# EAGLE design Ddraig (EAGLE 9.5.1)

## Sheet 1 of 8: Main
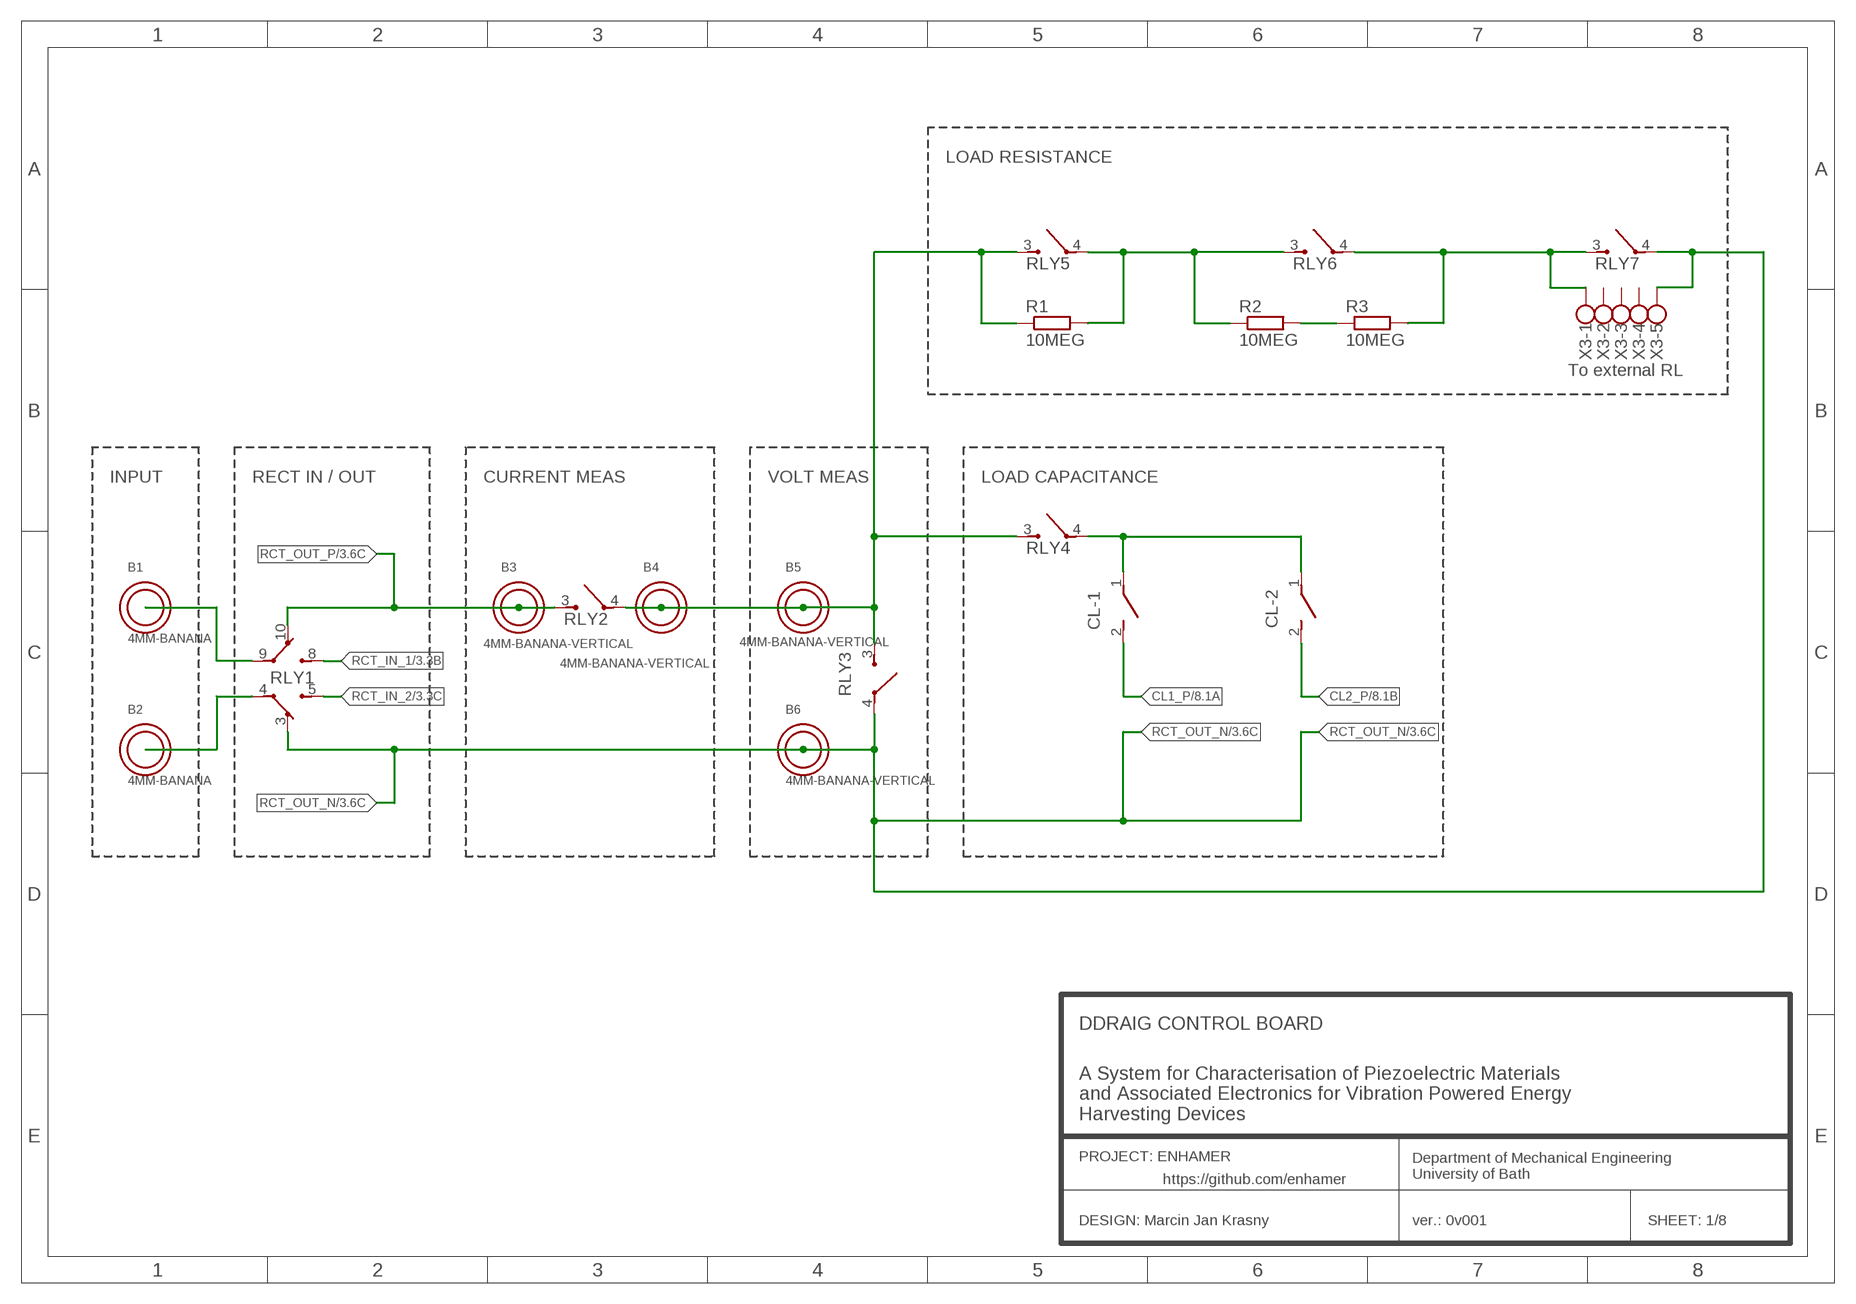
[diagram p0: schematic, sheet 1]

### Parts
B1  4MM-BANANA  4MM-BANANA-VERTICAL  [4MM-BANANA-VERTICAL]
B2  4MM-BANANA  4MM-BANANA-VERTICAL  [4MM-BANANA-VERTICAL]
B3  4MM-BANANA-VERTICAL  [4MM-BANANA-VERTICAL]
B4  4MM-BANANA-VERTICAL  [4MM-BANANA-VERTICAL]
B5  4MM-BANANA-VERTICAL  [4MM-BANANA-VERTICAL]
B6  4MM-BANANA-VERTICAL  [4MM-BANANA-VERTICAL]
CL-1  DIP_SWITCH_01  [DIP_SWITCH_01]
CL-2  DIP_SWITCH_01  [DIP_SWITCH_01]
R1  10MEG  R-EU_R2010  [R2010]
R2  10MEG  R-EU_R2010  [R2010]
R3  10MEG  R-EU_R2010  [R2010]
RLY1  AXICOM-V23079-D  [AXICOM-V23079-SMT_MONO]
RLY2  OMRON-G5CA-1A-E  [G5CA_MJK]
RLY3  OMRON-G5CA-1A-E  [G5CA_MJK]
RLY4  OMRON-G5CA-1A-E  [G5CA_MJK]
RLY5  OMRON-G5CA-1A-E  [G5CA_MJK]
RLY6  OMRON-G5CA-1A-E  [G5CA_MJK]
RLY7  OMRON-G5CA-1A-E  [G5CA_MJK]
X3  5PIN_CONN_RAST3.5MM  [5PIN_CONN_RAST3.5MM]

### Nets
CL1_P: CL-1.2 ; also sheet 8
CL2_P: CL-2.2 ; also sheet 8
N$1: B1.1 RLY1.9
N$2: B2.1 RLY1.4
N$4: B4.1 B5.1 R1.1 RLY2.4 RLY3.3 RLY4.3 RLY5.3
N$6: R3.2 RLY6.4 RLY7.3 X3.1
N$8: CL-1.1 CL-2.1 RLY4.4
N$10: R1.2 R2.1 RLY5.4 RLY6.3
N$11: R2.2 R3.1
RCT_IN_1: RLY1.8 ; also sheet 3
RCT_IN_2: RLY1.5 ; also sheet 3
RCT_OUT_N: B6.1 RLY1.3 RLY3.4 RLY7.4 X3.5 ; also sheet 3,8
RCT_OUT_P: B3.1 RLY1.10 RLY2.3 ; also sheet 3
Unconnected: X3.2 X3.3 X3.4

### Notes on the sheet
- LOAD RESISTANCE
- To external RL
- INPUT | RECT IN / OUT | CURRENT MEAS | VOLT MEAS | LOAD CAPACITANCE
- DDRAIG CONTROL BOARD
- A System for Characterisation of Piezoelectric Materials 
  and Associated Electronics for Vibration Powered Energy 
  Harvesting Devices
- PROJECT: ENHAMER
- Department of Mechanical Engineering
  University of Bath
- https://github.com/enhamer
- DESIGN: Marcin Jan Krasny | ver.: 0v001 | SHEET: 1/8

## Sheet 2 of 8: Power Supply
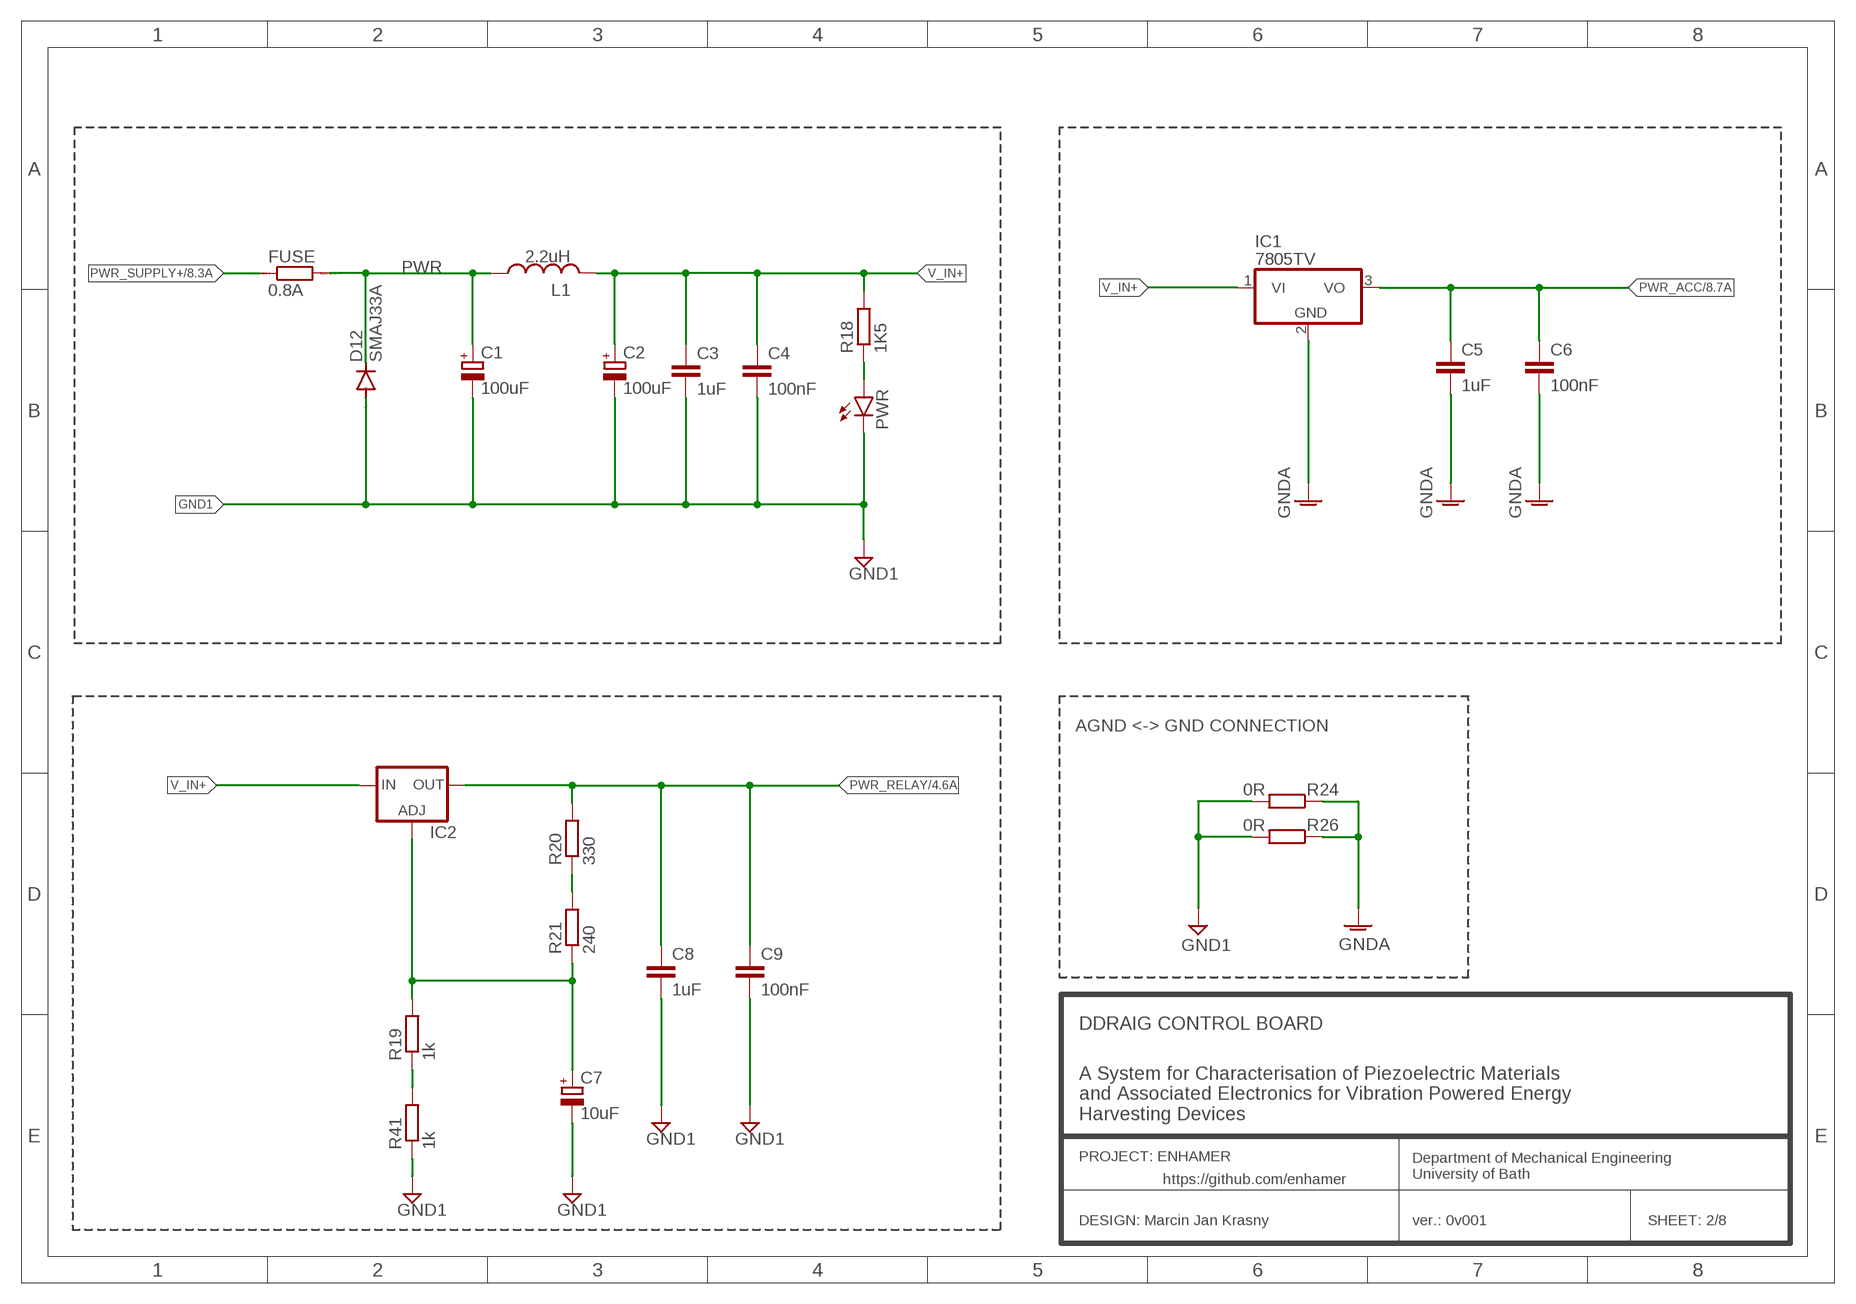
[diagram p1: schematic, sheet 2]

### Parts
C1  100uF  C_POL  [PANASONIC-CAPAE660X800N]
C2  100uF  C_POL  [PANASONIC-CAPAE660X800N]
C3  1uF  C-EUC0805  [C0805]
C4  100nF  C-EUC0805  [C0805]
C5  1uF  C-EUC0805  [C0805]
C6  100nF  C-EUC0805  [C0805]
C7  10uF  C_POL  [PANASONIC-CAPAE660X800N]
C8  1uF  C-EUC0805  [C0805]
C9  100nF  C-EUC0805  [C0805]
D12  SMAJ33A  DIODE-DO-214AC  [DO-214AC]
FUSE  0.8A  R1206  [1206]
IC1  7805TV  [TO220V]
IC2  LM317TS  [317TS]
L1  2.2uH  L0805_[2016_METRIC]  [0805]
PWR  LEDSMT1206  [1206]
R18  1K5  R-EU_R0805  [R0805]
R19  1k  R-EU_R0805  [R0805]
R20  330  R-EU_R0805  [R0805]
R21  240  R-EU_R0805  [R0805]
R24  0R  R-EU_R0805  [R0805]
R26  0R  R-EU_R0805  [R0805]
R41  1k  R-EU_R0805  [R0805]

### Nets
GND1: C1.2(-) C2.2(-) C3.2 C4.2 C7.2(-) C8.2 C9.2 D12.A PWR.C R24.2 R26.2 R41.1 ; also sheet 4,5,6,7,8
GNDA: C5.2 C6.2 IC1.2(GND) R24.1 R26.1 ; also sheet 8
N$41: PWR.A R18.1
N$42: C7.1(+) IC2.1(ADJ) R19.2 R21.1
N$43: R20.1 R21.2
N$57: R19.1 R41.2
PWR: C1.1(+) D12.C FUSE.2 L1.1
PWR_ACC: C5.1 C6.1 IC1.3(VO) ; also sheet 8
PWR_RELAY: C8.1 C9.1 IC2.2(OUT) R20.2 ; also sheet 4,5
PWR_SUPPLY+: FUSE.1 ; also sheet 8
V_IN+: C2.1(+) C3.1 C4.1 IC1.1(VI) IC2.3(IN) L1.2 R18.2

### Notes on the sheet
- Choke Input pi-Filter
- Fc     =    1 / (2pi x SQRT(L x C) [Hz]
  https://www.eeeguide.com/low-pass-filter/
- Reverse voltage protection
- V_in 8-15V
- AGND <-> GND CONNECTION
- Vout= 1.25 x (1+([R41+R19]/[R21+R20]))
- Vout = 5.28 V
- DDRAIG CONTROL BOARD
- A System for Characterisation of Piezoelectric Materials 
  and Associated Electronics for Vibration Powered Energy 
  Harvesting Devices
- PROJECT: ENHAMER
- Department of Mechanical Engineering
  University of Bath
- https://github.com/enhamer
- DESIGN: Marcin Jan Krasny | ver.: 0v001 | SHEET: 2/8

## Sheet 3 of 8: Rectifier
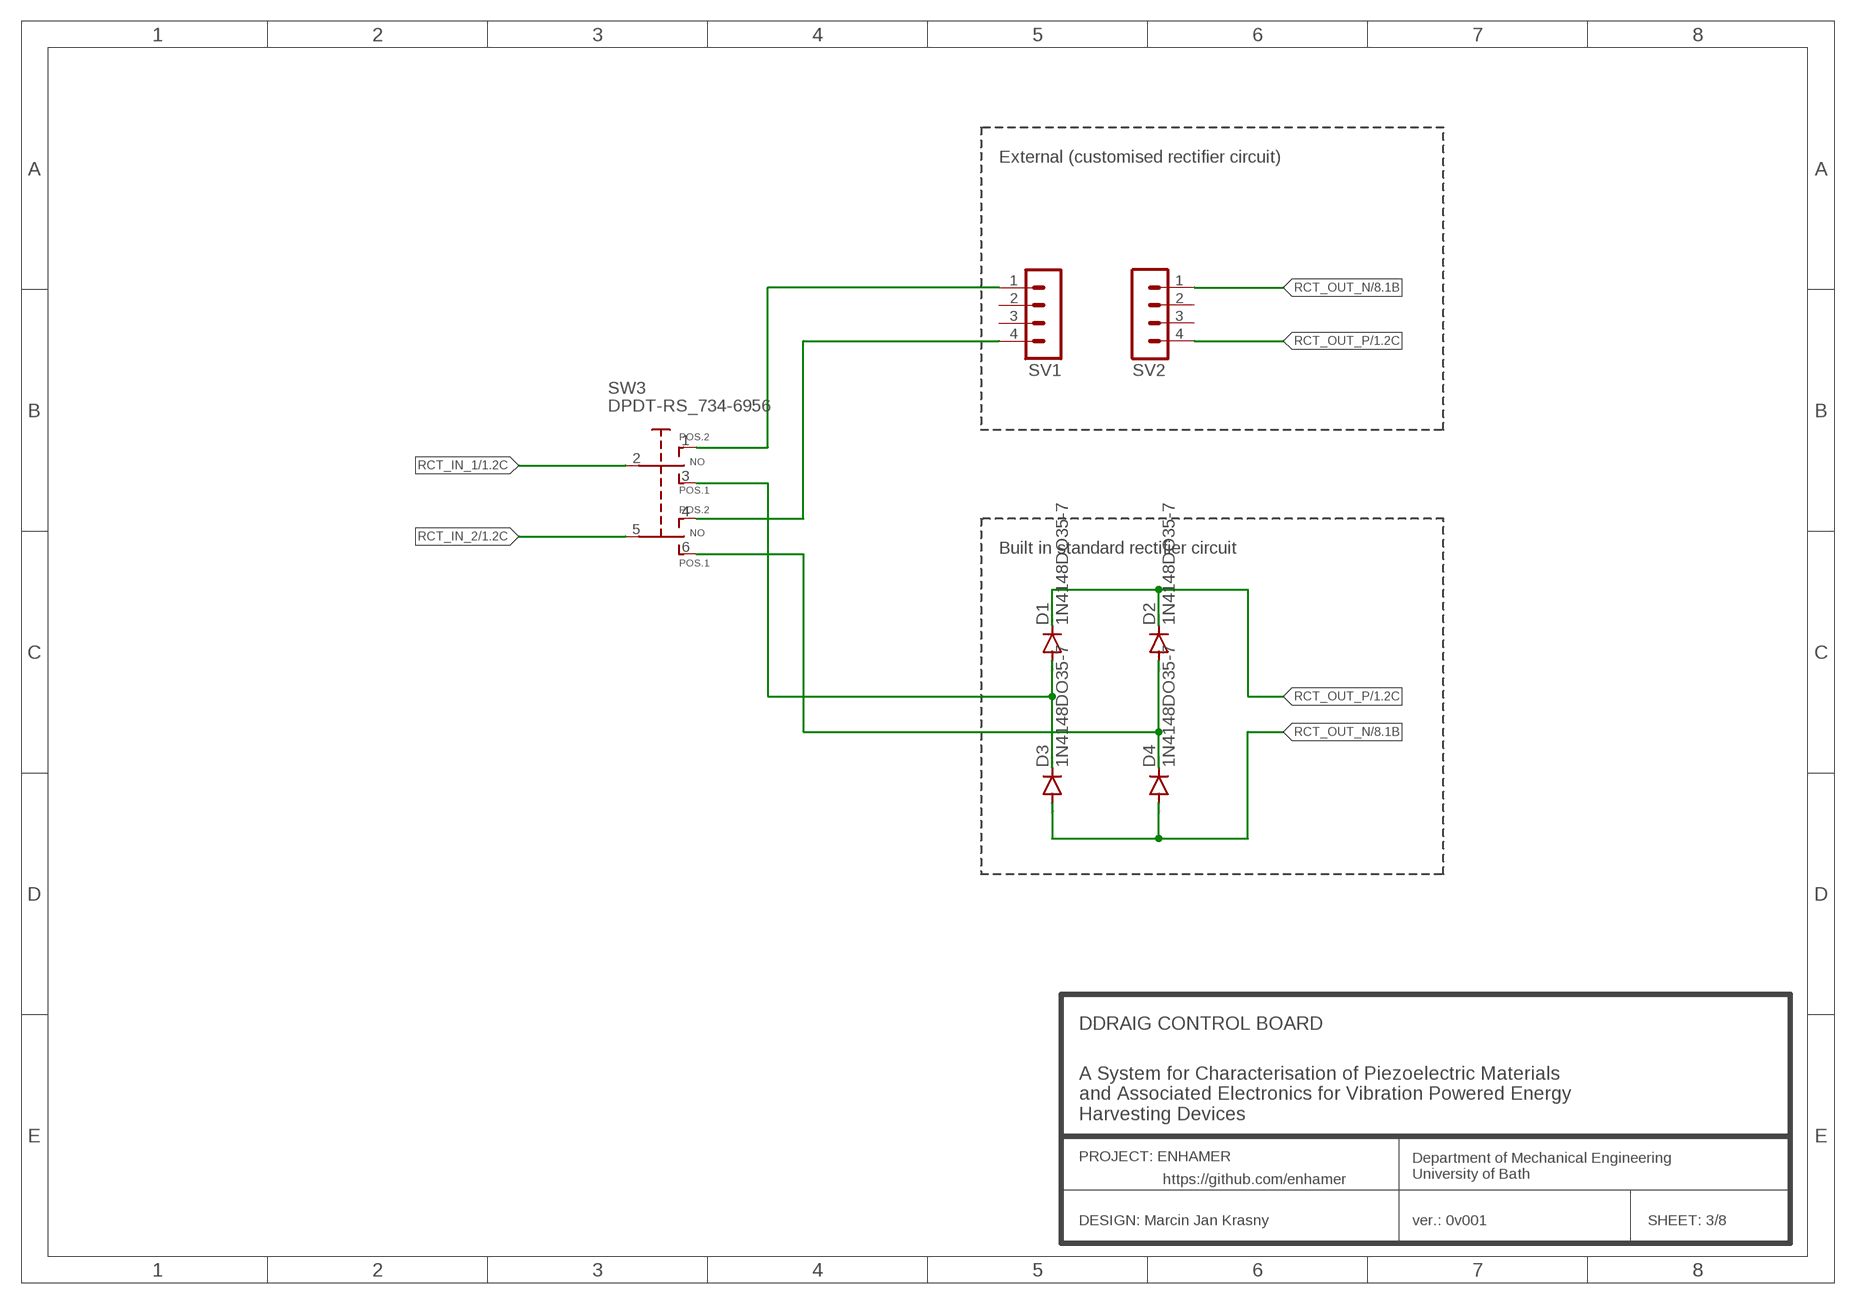
[diagram p2: schematic, sheet 3]

### Parts
D1  1N4148DO35-7  [DO35-7]
D2  1N4148DO35-7  [DO35-7]
D3  1N4148DO35-7  [DO35-7]
D4  1N4148DO35-7  [DO35-7]
SV1  MA04-1  [MA04-1]
SV2  MA04-1  [MA04-1]
SW3  DPDT-RS_734-6956  [DPDT-RS_734-6956]

### Nets
N$3: SV1.1 SW3.1
N$5: SV1.4 SW3.4
N$7: D1.A D3.C SW3.3
N$9: D2.A D4.C SW3.6
RCT_IN_1: SW3.2 ; also sheet 1
RCT_IN_2: SW3.5 ; also sheet 1
RCT_OUT_N: D3.A D4.A SV2.1 ; also sheet 1,8
RCT_OUT_P: D1.C D2.C SV2.4 ; also sheet 1
Unconnected: SV1.2 SV1.3 SV2.2 SV2.3

### Notes on the sheet
- External (customised rectifier circuit)
- Toggle Switch:
  RS PRO Double Pole Double Throw (DPDT),
  On-Off-On, Panel Mount
  RS Stock No. 448-0775
- Built in standard rectifier circuit
- DDRAIG CONTROL BOARD
- A System for Characterisation of Piezoelectric Materials 
  and Associated Electronics for Vibration Powered Energy 
  Harvesting Devices
- PROJECT: ENHAMER
- Department of Mechanical Engineering
  University of Bath
- https://github.com/enhamer
- DESIGN: Marcin Jan Krasny | ver.: 0v001 | SHEET: 3/8

## Sheet 4 of 8: Relays Ctrl #1
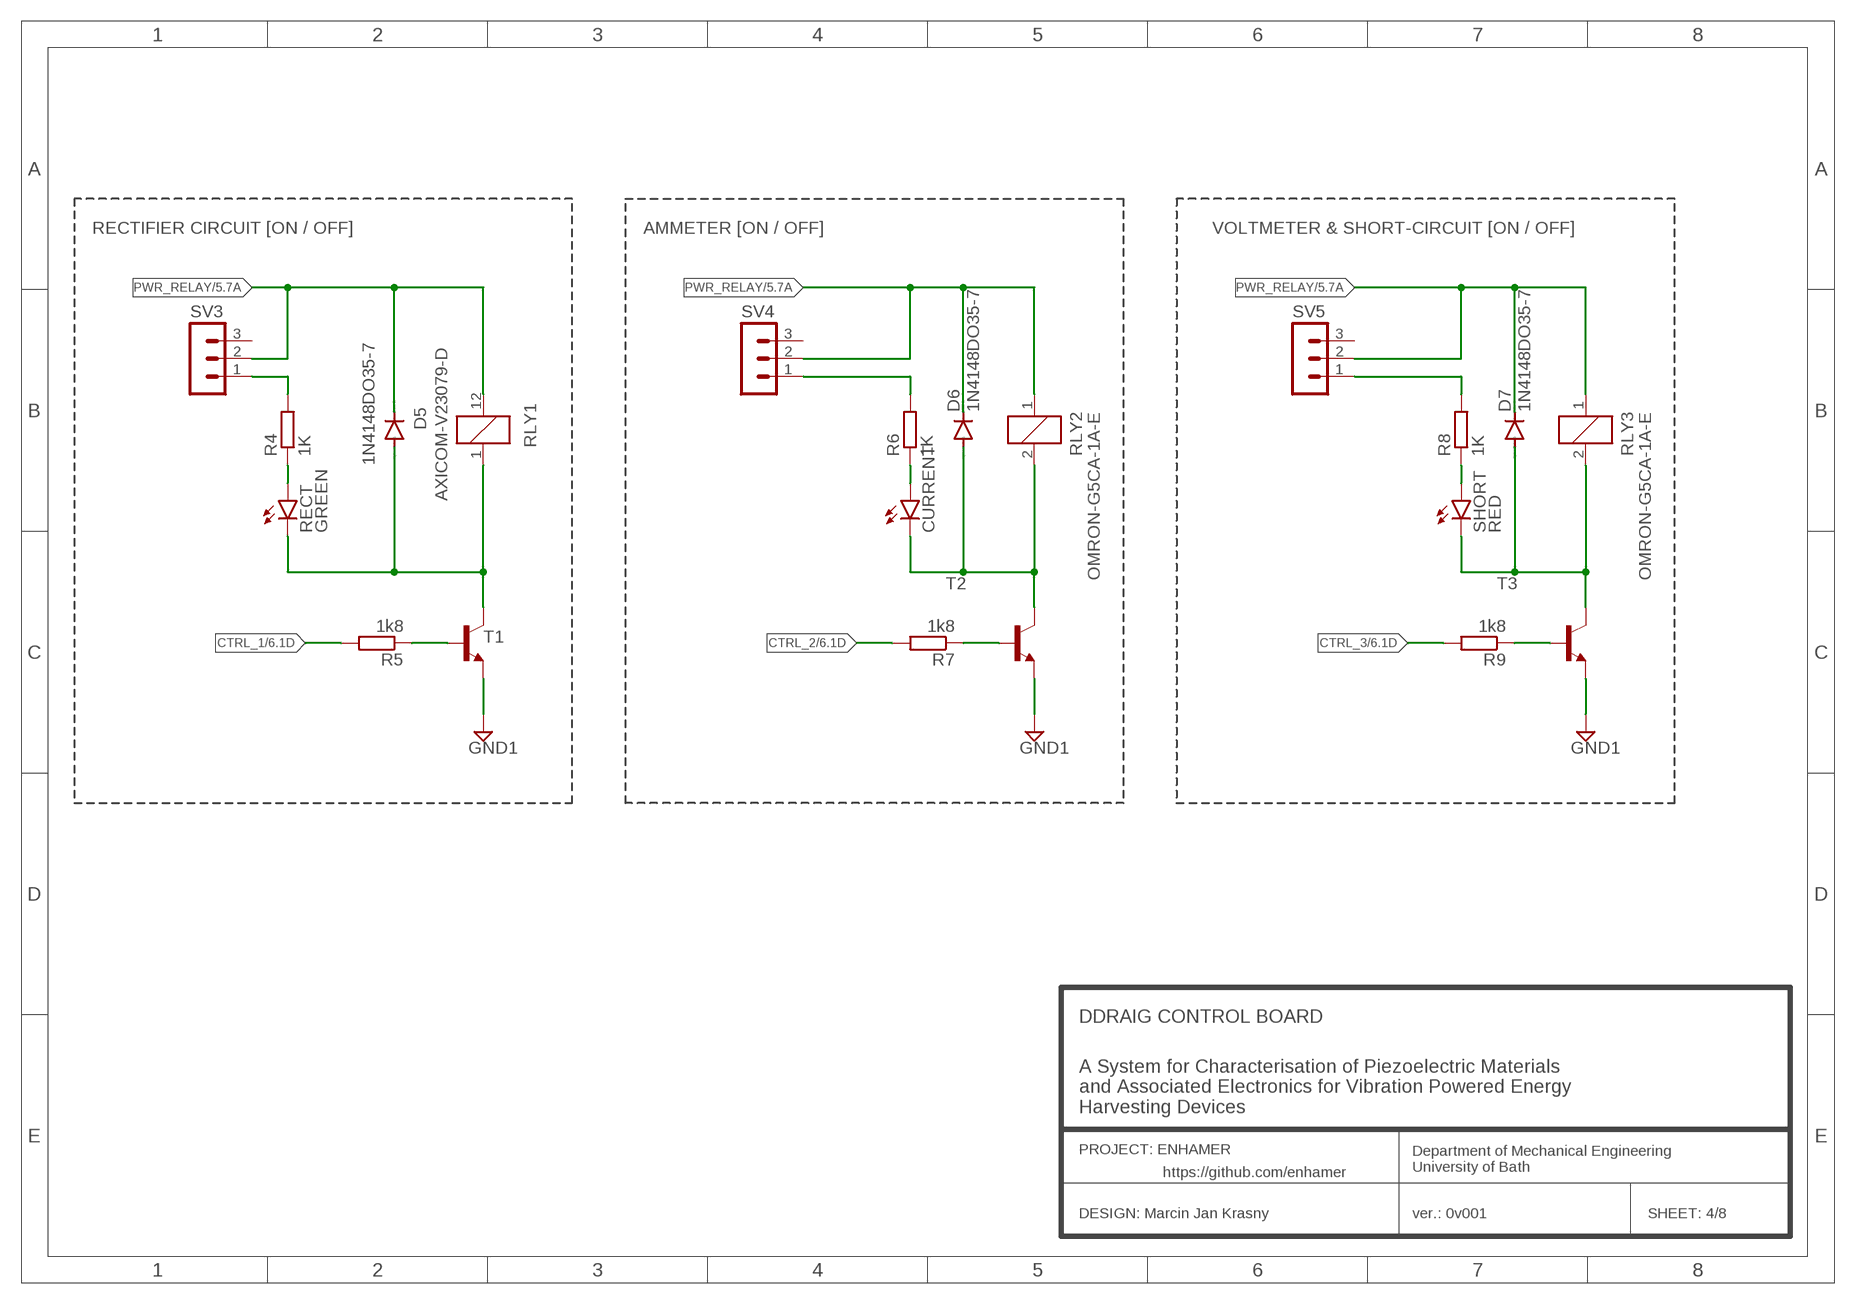
[diagram p3: schematic, sheet 4]

### Parts
CURRENT  LEDSMT1206  [1206]
D5  1N4148DO35-7  [DO35-7]
D6  1N4148DO35-7  [DO35-7]
D7  1N4148DO35-7  [DO35-7]
R4  1K  R-EU_R0805  [R0805]
R5  1k8  R-EU_R0805  [R0805]
R6  1K  R-EU_R0805  [R0805]
R7  1k8  R-EU_R0805  [R0805]
R8  1K  R-EU_R0805  [R0805]
R9  1k8  R-EU_R0805  [R0805]
RECT  GREEN  LEDSMT1206  [1206]
SHORT  RED  LEDSMT1206  [1206]
SV3  MA03-1  [MA03-1]
SV4  MA03-1  [MA03-1]
SV5  MA03-1  [MA03-1]
T1  BC337-25-NPN-TO92-CBE  [TO92-CBE]
T2  BC337-25-NPN-TO92-CBE  [TO92-CBE]
T3  BC337-25-NPN-TO92-CBE  [TO92-CBE]

### Nets
CTRL_1: R5.2 ; also sheet 6
CTRL_2: R7.2 ; also sheet 6
CTRL_3: R9.2 ; also sheet 6
GND1: T1.E T2.E T3.E ; also sheet 2,5,6,7,8
N$12: R4.2 SV3.1
N$13: R4.1 RECT.A
N$14: D5.A RECT.C RLY1.1 T1.C
N$15: CURRENT.A R6.1
N$16: CURRENT.C D6.A RLY2.2 T2.C
N$17: R5.1 T1.B
N$18: R6.2 SV4.1
N$19: R7.1 T2.B
N$20: R8.1 SHORT.A
N$21: D7.A RLY3.2 SHORT.C T3.C
N$22: R8.2 SV5.1
N$23: R9.1 T3.B
PWR_RELAY: D5.C D6.C D7.C RLY1.12 RLY2.1 RLY3.1 SV3.2 SV4.2 SV5.2 ; also sheet 2,5
Unconnected: SV3.3 SV4.3 SV5.3

### Notes on the sheet
- RECTIFIER CIRCUIT [ON / OFF] | AMMETER [ON / OFF] | VOLTMETER & SHORT-CIRCUIT [ON / OFF]
- DDRAIG CONTROL BOARD
- A System for Characterisation of Piezoelectric Materials 
  and Associated Electronics for Vibration Powered Energy 
  Harvesting Devices
- PROJECT: ENHAMER
- Department of Mechanical Engineering
  University of Bath
- https://github.com/enhamer
- DESIGN: Marcin Jan Krasny | ver.: 0v001 | SHEET: 4/8

## Sheet 5 of 8: Relays Ctrl #2
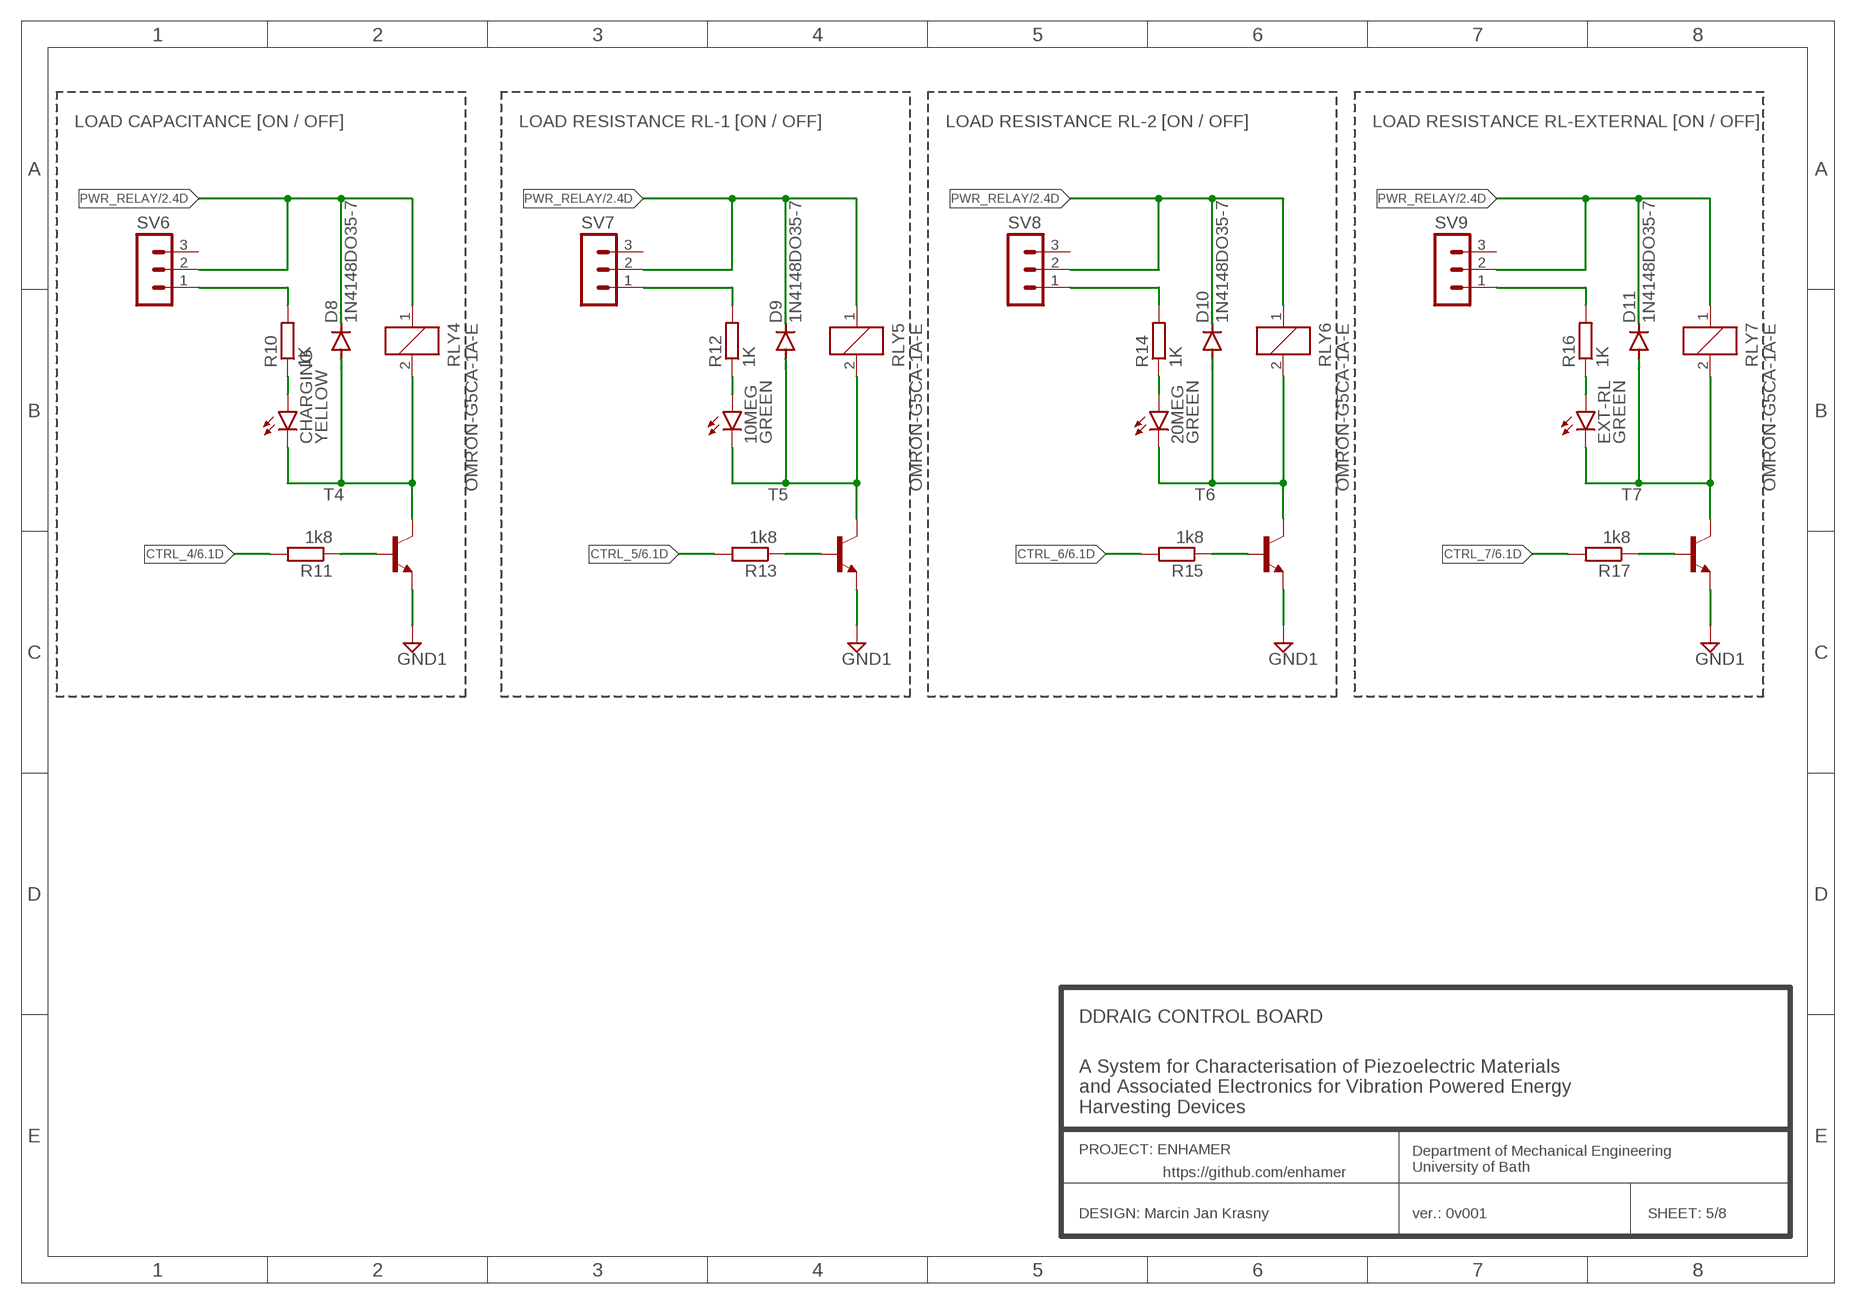
[diagram p4: schematic, sheet 5]

### Parts
10MEG  GREEN  LEDSMT1206  [1206]
20MEG  GREEN  LEDSMT1206  [1206]
CHARGING  YELLOW  LEDSMT1206  [1206]
D8  1N4148DO35-7  [DO35-7]
D9  1N4148DO35-7  [DO35-7]
D10  1N4148DO35-7  [DO35-7]
D11  1N4148DO35-7  [DO35-7]
EXT-RL  GREEN  LEDSMT1206  [1206]
R10  1K  R-EU_R0805  [R0805]
R11  1k8  R-EU_R0805  [R0805]
R12  1K  R-EU_R0805  [R0805]
R13  1k8  R-EU_R0805  [R0805]
R14  1K  R-EU_R0805  [R0805]
R15  1k8  R-EU_R0805  [R0805]
R16  1K  R-EU_R0805  [R0805]
R17  1k8  R-EU_R0805  [R0805]
SV6  MA03-1  [MA03-1]
SV7  MA03-1  [MA03-1]
SV8  MA03-1  [MA03-1]
SV9  MA03-1  [MA03-1]
T4  BC337-25-NPN-TO92-CBE  [TO92-CBE]
T5  BC337-25-NPN-TO92-CBE  [TO92-CBE]
T6  BC337-25-NPN-TO92-CBE  [TO92-CBE]
T7  BC337-25-NPN-TO92-CBE  [TO92-CBE]

### Nets
CTRL_4: R11.2 ; also sheet 6
CTRL_5: R13.2 ; also sheet 6
CTRL_6: R15.2 ; also sheet 6
CTRL_7: R17.2 ; also sheet 6
GND1: T4.E T5.E T6.E T7.E ; also sheet 2,4,6,7,8
N$24: CHARGING.A R10.1
N$25: CHARGING.C D8.A RLY4.2 T4.C
N$26: R10.2 SV6.1
N$27: R11.1 T4.B
N$28: 10MEG.A R12.1
N$29: 10MEG.C D9.A RLY5.2 T5.C
N$30: R12.2 SV7.1
N$31: R13.1 T5.B
N$32: 20MEG.A R14.1
N$33: 20MEG.C D10.A RLY6.2 T6.C
N$34: R14.2 SV8.1
N$35: R15.1 T6.B
N$36: EXT-RL.A R16.1
N$37: D11.A EXT-RL.C RLY7.2 T7.C
N$38: R16.2 SV9.1
N$39: R17.1 T7.B
PWR_RELAY: D8.C D9.C D10.C D11.C RLY4.1 RLY5.1 RLY6.1 RLY7.1 SV6.2 SV7.2 SV8.2 SV9.2 ; also sheet 2,4
Unconnected: SV6.3 SV7.3 SV8.3 SV9.3

### Notes on the sheet
- LOAD CAPACITANCE [ON / OFF] | LOAD RESISTANCE RL-1 [ON / OFF] | LOAD RESISTANCE RL-2 [ON / OFF] | LOAD RESISTANCE RL-EXTERNAL [ON / OFF]
- DDRAIG CONTROL BOARD
- A System for Characterisation of Piezoelectric Materials 
  and Associated Electronics for Vibration Powered Energy 
  Harvesting Devices
- PROJECT: ENHAMER
- Department of Mechanical Engineering
  University of Bath
- https://github.com/enhamer
- DESIGN: Marcin Jan Krasny | ver.: 0v001 | SHEET: 5/8

## Sheet 6 of 8: External Ctrl Logic
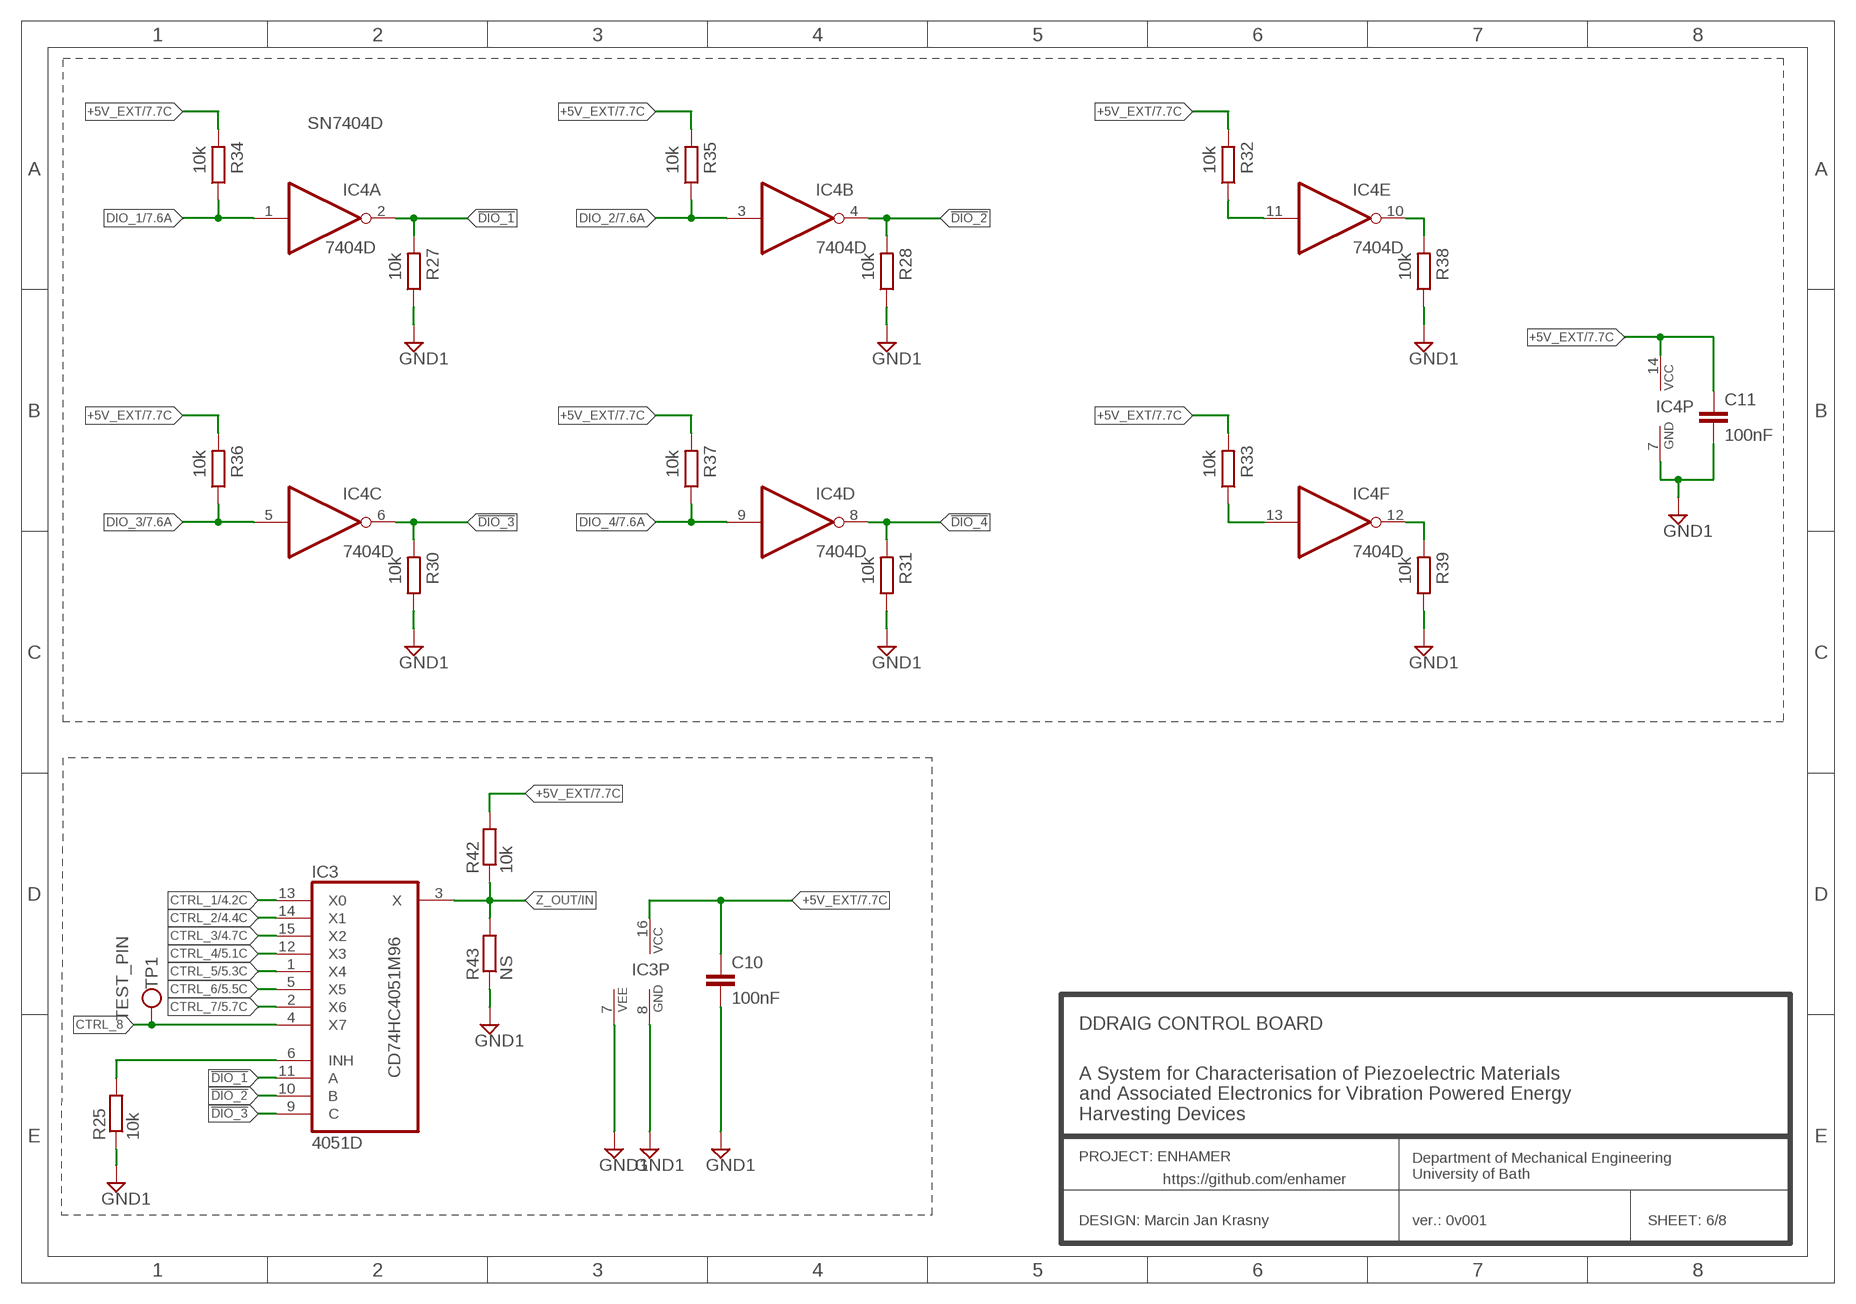
[diagram p5: schematic, sheet 6]

### Parts
C10  100nF  C-EUC0805  [C0805]
C11  100nF  C-EUC0805  [C0805]
IC3  4051D  [SO16]
IC4  7404D  [SO14]
R25  10k  R-EU_R0805  [R0805]
R27  10k  R-EU_R0805  [R0805]
R28  10k  R-EU_R0805  [R0805]
R30  10k  R-EU_R0805  [R0805]
R31  10k  R-EU_R0805  [R0805]
R32  10k  R-EU_R0805  [R0805]
R33  10k  R-EU_R0805  [R0805]
R34  10k  R-EU_R0805  [R0805]
R35  10k  R-EU_R0805  [R0805]
R36  10k  R-EU_R0805  [R0805]
R37  10k  R-EU_R0805  [R0805]
R38  10k  R-EU_R0805  [R0805]
R39  10k  R-EU_R0805  [R0805]
R42  10k  R-EU_R0805  [R0805]
R43  NS  R-EU_R0805  [R0805]
TP1  TEST_PIN  [1-TEST_PIN]

### Nets
!DIO_1: IC3.11(A) IC4.2(A:O) R27.2
!DIO_2: IC3.10(B) IC4.4(B:O) R28.2
!DIO_3: IC3.9(C) IC4.6(C:O) R30.2
!DIO_4: IC4.8(D:O) R31.2
+5V_EXT: C10.1 C11.1 IC3.16(VCC) IC4.14(P:VCC) R32.2 R33.2 R34.2 R35.2 R36.2 R37.2 R42.2 ; also sheet 7
CTRL_1: IC3.13(X0) ; also sheet 4
CTRL_2: IC3.14(X1) ; also sheet 4
CTRL_3: IC3.15(X2) ; also sheet 4
CTRL_4: IC3.12(X3) ; also sheet 5
CTRL_5: IC3.1(X4) ; also sheet 5
CTRL_6: IC3.5(X5) ; also sheet 5
CTRL_7: IC3.2(X6) ; also sheet 5
CTRL_8: IC3.4(X7) TP1.1(KL)
DIO_1: IC4.1(A:I) R34.1 ; also sheet 7
DIO_2: IC4.3(B:I) R35.1 ; also sheet 7
DIO_3: IC4.5(C:I) R36.1 ; also sheet 7
DIO_4: IC4.9(D:I) R37.1 ; also sheet 7
GND1: C10.2 C11.2 IC3.7(VEE) IC3.8(GND) IC4.7(P:GND) R25.1 R27.1 R28.1 R30.1 R31.1 R38.1 R39.1 R43.1 ; also sheet 2,4,5,7,8
N$40: IC4.11(E:I) R32.1
N$52: IC3.6(INH) R25.2
N$53: IC4.13(F:I) R33.1
N$54: IC4.10(E:O) R38.2
N$55: IC4.12(F:O) R39.2
Z_OUT/IN: IC3.3(X) R42.1 R43.2

### Notes on the sheet
- SN7404D
- DDRAIG CONTROL BOARD
- CD74HC4051M96
- A System for Characterisation of Piezoelectric Materials 
  and Associated Electronics for Vibration Powered Energy 
  Harvesting Devices
- PROJECT: ENHAMER
- Department of Mechanical Engineering
  University of Bath
- https://github.com/enhamer
- DESIGN: Marcin Jan Krasny | ver.: 0v001 | SHEET: 6/8

## Sheet 7 of 8: External Ctrl Connectors
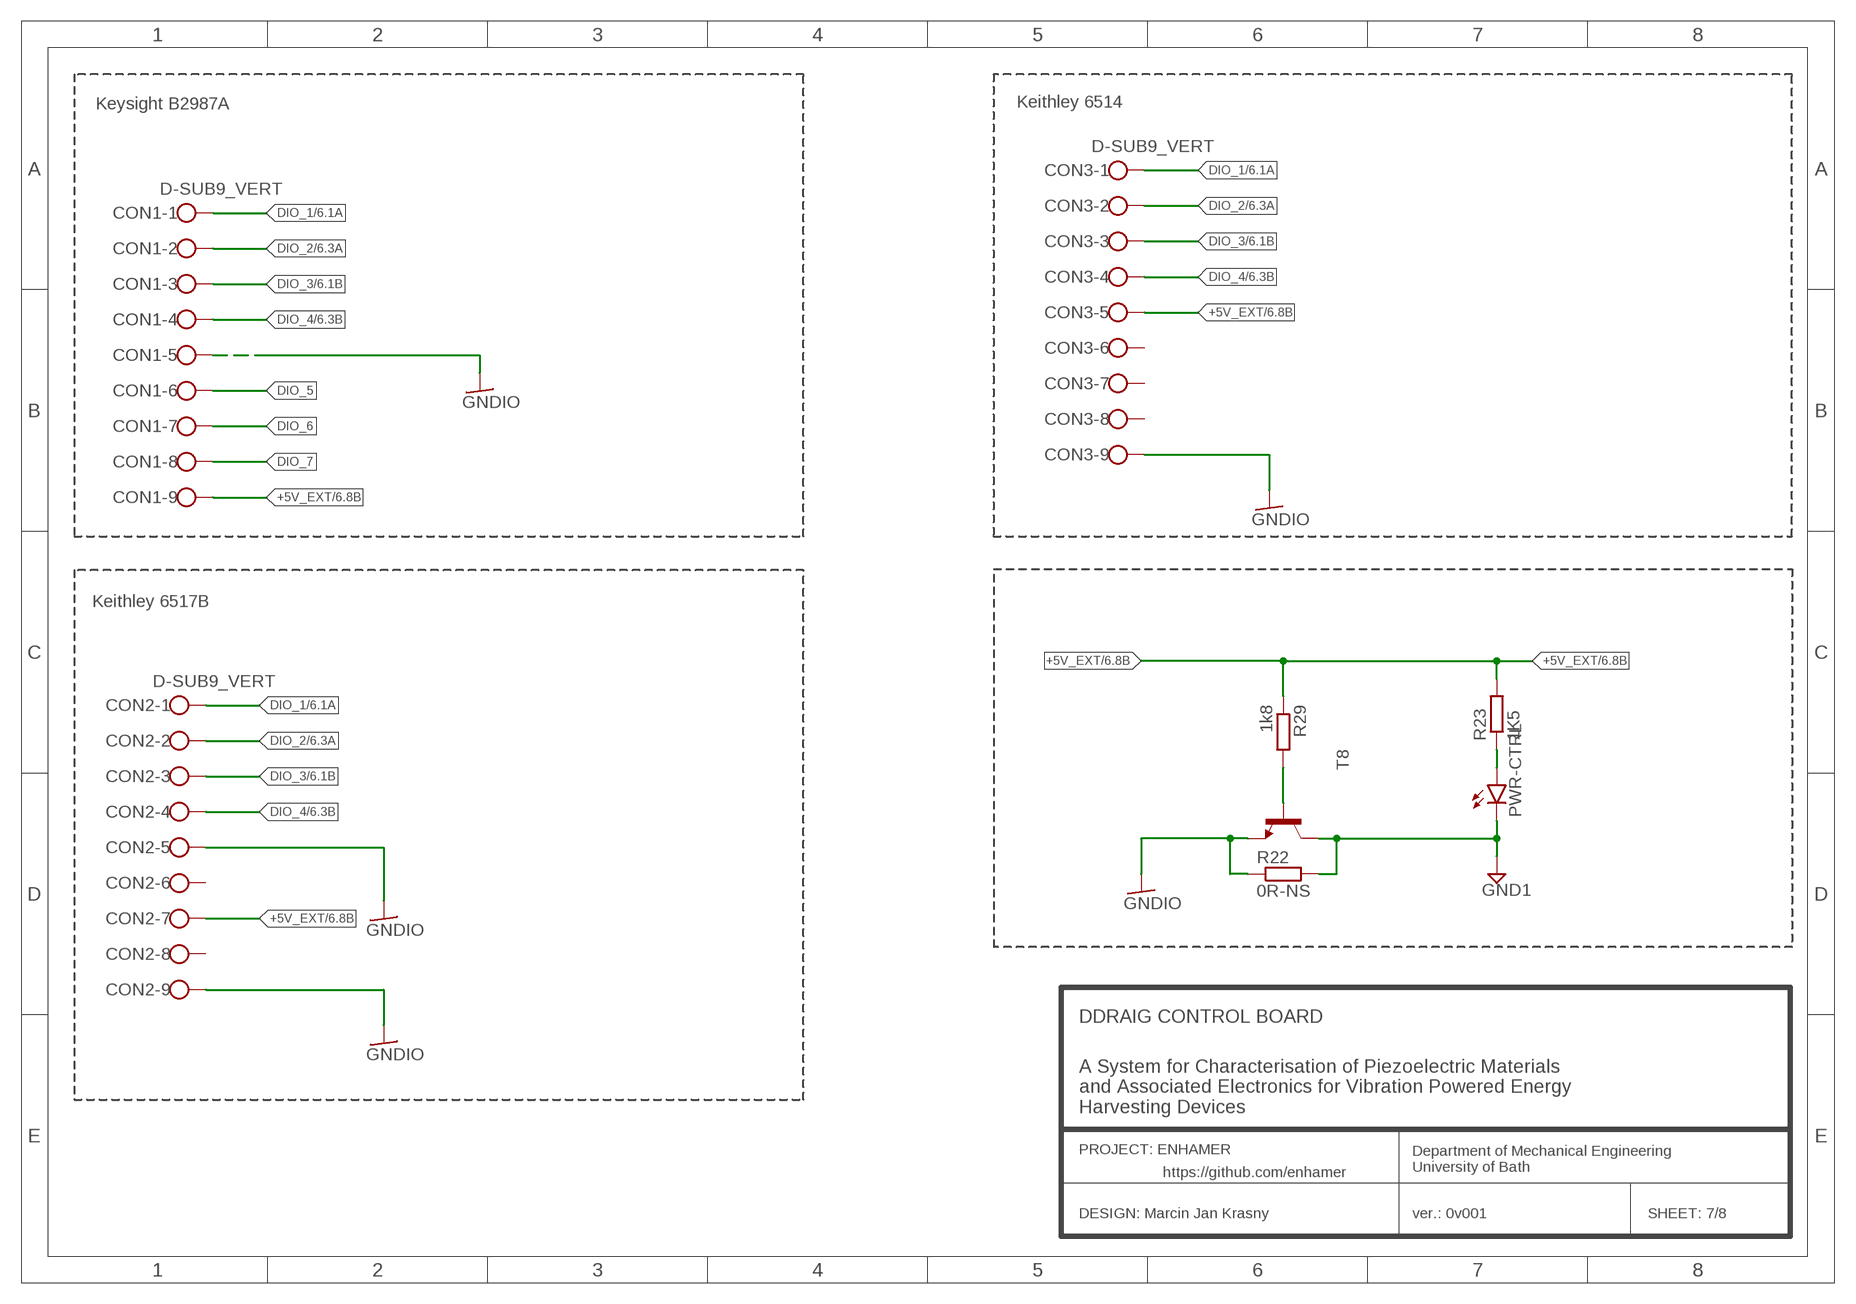
[diagram p6: schematic, sheet 7]

### Parts
CON1  D-SUB9_VERT  [D-SUB9-VERTICAL]
CON2  D-SUB9_VERT  [D-SUB9-VERTICAL]
CON3  D-SUB9_VERT  [D-SUB9-VERTICAL]
PWR-CTRL  LEDSMT1206  [1206]
R22  0R-NS  R-EU_R0805  [R0805]
R23  1K5  R-EU_R0805  [R0805]
R29  1k8  R-EU_R0805  [R0805]
T8  BC337-25-NPN-TO92-CBE  [TO92-CBE]

### Nets
+5V_EXT: CON1.9 CON2.7 CON3.5 R23.2 R29.1 ; also sheet 6
DIO_1: CON1.1 CON2.1 CON3.1 ; also sheet 6
DIO_2: CON1.2 CON2.2 CON3.2 ; also sheet 6
DIO_3: CON1.3 CON2.3 CON3.3 ; also sheet 6
DIO_4: CON1.4 CON2.4 CON3.4 ; also sheet 6
DIO_5: CON1.6
DIO_6: CON1.7
DIO_7: CON1.8
GND1: PWR-CTRL.C R22.2 T8.C ; also sheet 2,4,5,6,8
GNDIO: CON1.5 CON2.5 CON2.9 CON3.9 R22.1 T8.E
N$49: PWR-CTRL.A R23.1
N$50: R29.2 T8.B
Unconnected: CON2.6 CON2.8 CON3.6 CON3.7 CON3.8

### Notes on the sheet
- Keysight B2987A | Keithley 6514
- Keithley 6517B
- Visual connection indicator
  of external logic controler
- DDRAIG CONTROL BOARD
- A System for Characterisation of Piezoelectric Materials 
  and Associated Electronics for Vibration Powered Energy 
  Harvesting Devices
- PROJECT: ENHAMER
- Department of Mechanical Engineering
  University of Bath
- https://github.com/enhamer
- DESIGN: Marcin Jan Krasny | ver.: 0v001 | SHEET: 7/8

## Sheet 8 of 8: Connectors
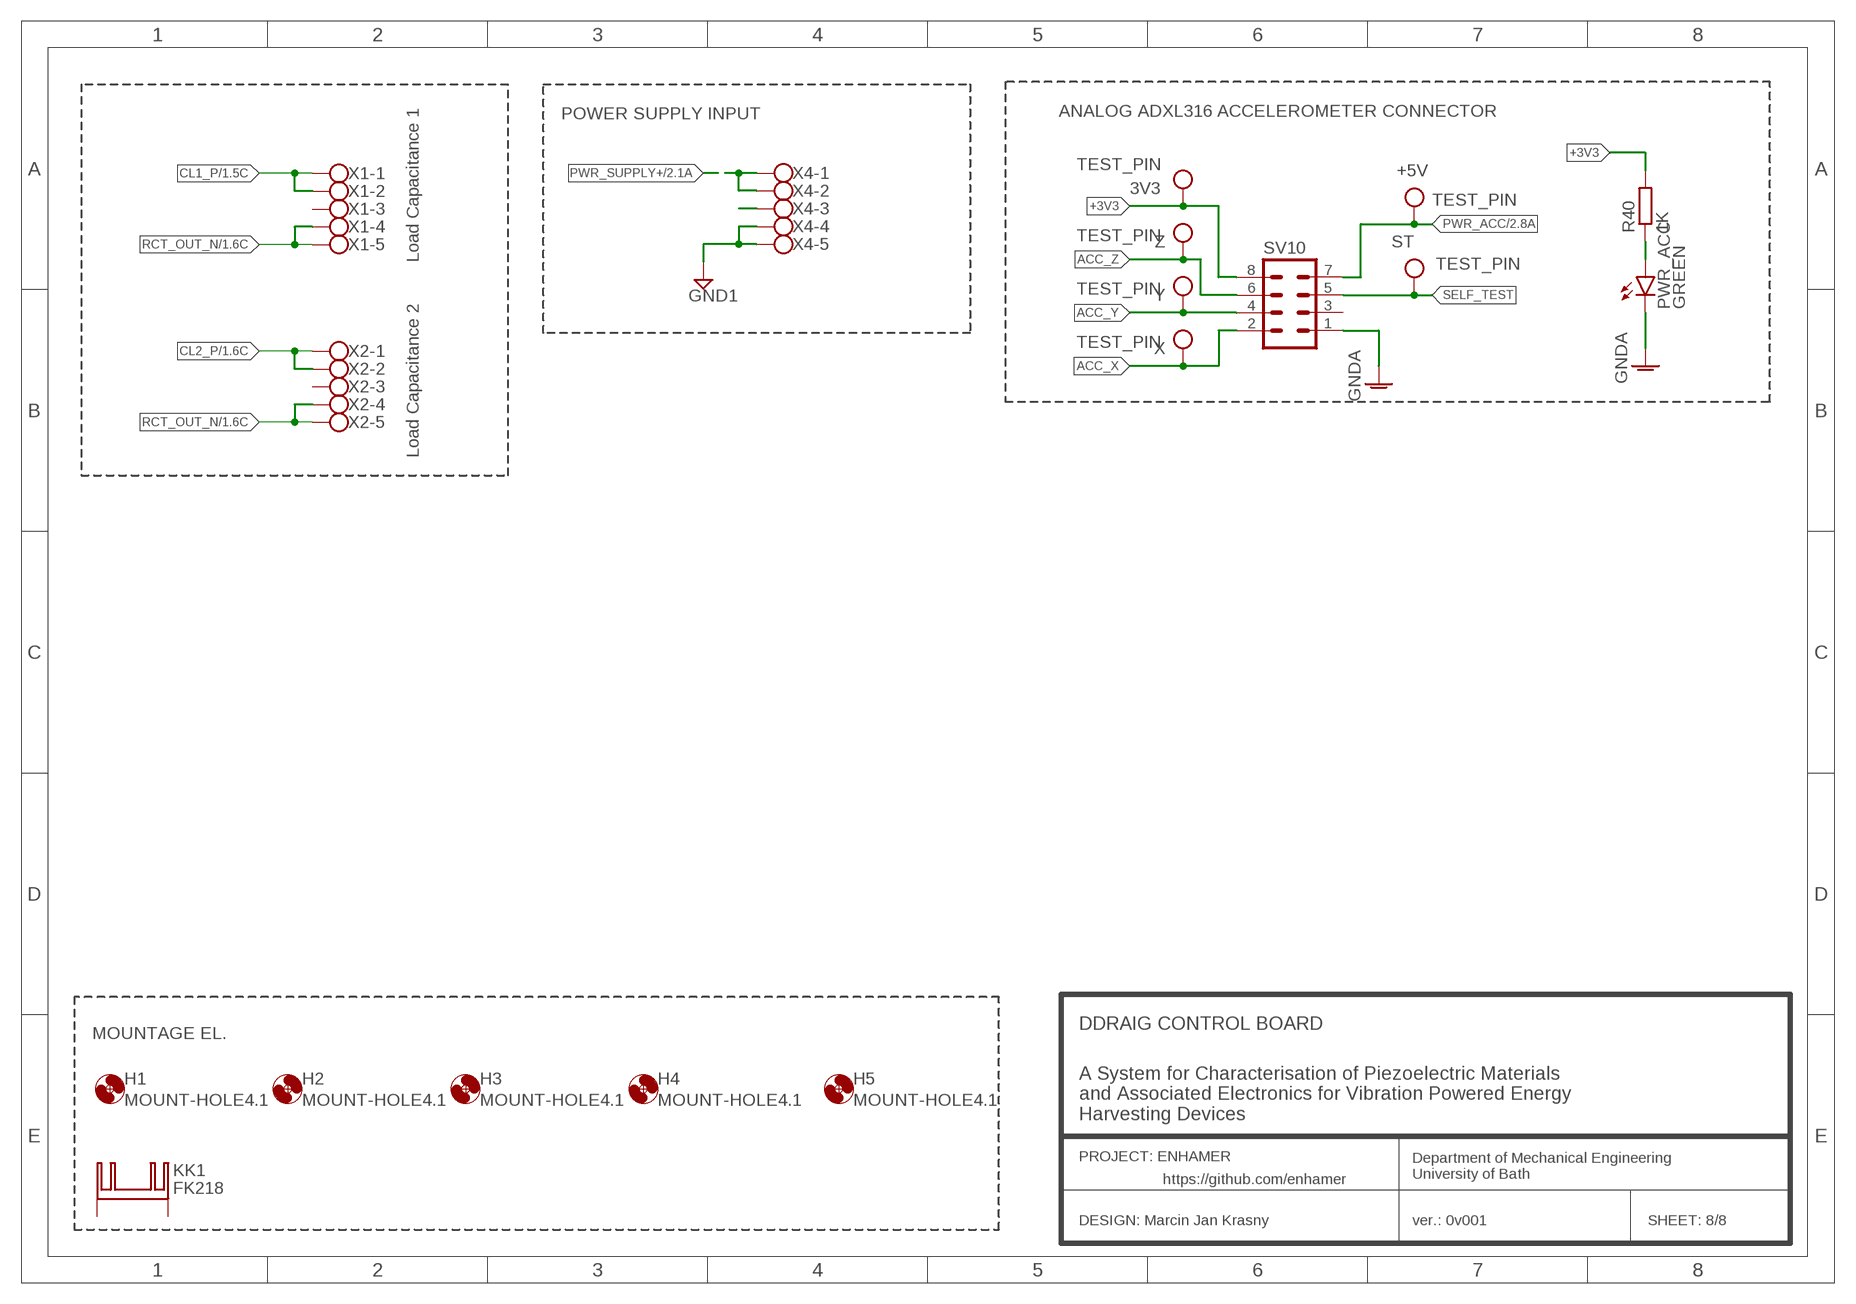
[diagram p7: schematic, sheet 8]

### Parts
3V3  TEST_PIN  [1-TEST_PIN]
+5V  TEST_PIN  [1-TEST_PIN]
H1  MOUNT-HOLE4.1  [4,1]
H2  MOUNT-HOLE4.1  [4,1]
H3  MOUNT-HOLE4.1  [4,1]
H4  MOUNT-HOLE4.1  [4,1]
H5  MOUNT-HOLE4.1  [4,1]
KK1  FK218  [FK218]
PWR_ACC  GREEN  LEDSMT1206  [1206]
R40  1K  R-EU_R0805  [R0805]
ST  TEST_PIN  [1-TEST_PIN]
SV10  MA04-2  [MA04-2]
X  TEST_PIN  [1-TEST_PIN]
X1  5PIN_CONN_RAST3.5MM  [5PIN_CONN_RAST3.5MM]
X2  5PIN_CONN_RAST3.5MM  [5PIN_CONN_RAST3.5MM]
X4  5PIN_CONN_RAST3.5MM  [5PIN_CONN_RAST3.5MM]
Y  TEST_PIN  [1-TEST_PIN]
Z  TEST_PIN  [1-TEST_PIN]

### Nets
+3V3: 3V3.1(KL) R40.2 SV10.8
ACC_X: SV10.2 X.1(KL)
ACC_Y: SV10.4 Y.1(KL)
ACC_Z: SV10.6 Z.1(KL)
CL1_P: X1.1 X1.2 ; also sheet 1
CL2_P: X2.1 X2.2 ; also sheet 1
GND1: X4.4 X4.5 ; also sheet 2,4,5,6,7
GNDA: PWR_ACC.C SV10.1 ; also sheet 2
N$51: X4.3
N$56: PWR_ACC.A R40.1
PWR_ACC: +5V.1(KL) SV10.7 ; also sheet 2
PWR_SUPPLY+: X4.1 X4.2 ; also sheet 2
RCT_OUT_N: X1.4 X1.5 X2.4 X2.5 ; also sheet 1,3
SELF_TEST: ST.1(KL) SV10.5
Unconnected: KK1.A2,2(K) KK1.B2,2(K) SV10.3 X1.3 X2.3

### Notes on the sheet
- POWER SUPPLY INPUT | ANALOG ADXL316 ACCELEROMETER CONNECTOR
- Load Capacitance 1
- Load Capacitance 2
- DDRAIG CONTROL BOARD
- MOUNTAGE EL.
- A System for Characterisation of Piezoelectric Materials 
  and Associated Electronics for Vibration Powered Energy 
  Harvesting Devices
- PROJECT: ENHAMER
- Department of Mechanical Engineering
  University of Bath
- https://github.com/enhamer
- DESIGN: Marcin Jan Krasny | ver.: 0v001 | SHEET: 8/8

## Library data of the parts
3V3 +5V ST TP1 X Y Z = _Connectors_Krasny:TEST_PIN
10MEG 20MEG CHARGING CURRENT EXT-RL PWR PWR-CTRL PWR_ACC RECT SHORT = _SMT_Krasny_lib:LED: LED OSRAM: - CHIPLED LG R971, LG N971, LY N971, LG Q971, LY Q971, LO R971, LY R971 LH N974, LH R974 LS Q976, LO Q976, LY Q976 LO Q996 - Hyper CHIPLED LW Q18S LB Q993, LB Q99A, LB R99A - SideLED LS A670, LO A670, LY A670, LG A670, LP A670 LB A673, LV A673, LT A673, LW A673 LH A674 LY A675 LS A676, LA A676, LO A676, LY A676, LW A676 LS A679, LY A679, LG A679 - Hyper Micro SIDELED® LS Y876, LA Y876, LO Y876, LY Y876 LT Y87S - SmartLED LW L88C, LW L88S LB L89C, LB L89S, LG L890 LS L89K, LO L89K, LY L89K LS L896, LA L896, LO L896, LY L896 - TOPLED LS T670, LO T670, LY T670, LG T670, LP T670 LSG T670, LSP T670, LSY T670, LOP T670, LYG T670 LG T671, LOG T671, LSG T671 LB T673, LV T673, LT T673, LW T673 LH T674 LS T676, LA T676, LO T676, LY T676, LB T676, LH T676, LSB T676, LW T676 LB T67C, LV T67C, LT T67C, LS T67K, LO T67K, LY T67K, LW E67C LS E67B, LA E67B, LO E67B, LY E67B, LB E67C, LV E67C, LT E67C LW T67C LS T679, LY T679, LG T679 LS T770, LO T770, LY T770, LG T770, LP T770 LB T773, LV T773, LT T773, LW T773 LH T774 LS E675, LA E675, LY E675, LS T675 LS T776, LA T776, LO T776, LY T776, LB T776 LHGB T686 LT T68C, LB T68C - Hyper Mini TOPLED® LB M676 - Mini TOPLED Santana® LG M470 LS M47K, LO M47K, LY M47K Source: http://www.osram.convergy.de LUXEON: - LUMILED® LXK2-PW12-R00, LXK2-PW12-S00, LXK2-PW14-U00, LXK2-PW14-V00 LXK2-PM12-R00, LXK2-PM12-S00, LXK2-PM14-U00 LXK2-PE12-Q00, LXK2-PE12-R00, LXK2-PE12-S00, LXK2-PE14-T00, LXK2-PE14-U00 LXK2-PB12-K00, LXK2-PB12-L00, LXK2-PB12-M00, LXK2-PB14-N00, LXK2-PB14-P00, LXK2-PB14-Q00 LXK2-PR12-L00, LXK2-PR12-M00, LXK2-PR14-Q00, LXK2-PR14-R00 LXK2-PD12-Q00, LXK2-PD12-R00, LXK2-PD12-S00 LXK2-PH12-R00, LXK2-PH12-S00 LXK2-PL12-P00, LXK2-PL12-Q00, LXK2-PL12-R00 Source: www.luxeon.com KINGBRIGHT: KA-3528ASYC Source: www.kingbright.com
B1-B6 = _Connectors_Krasny:4MM-BANANA-VERTICAL
C1 C2 C7 = _passive_Krasny:C_POL
C3-C6 C8-C11 = rcl:C-EU: CAPACITOR, European symbol; SPICEPREFIX: C
CL-1 CL-2 = _Connectors_Krasny:DIP_SWITCH_01
CON1-CON3 = _Connectors_Krasny:D-SUB9_VERT: TE Connectivity AMPLIMITE HD-20 Series, 9 Way PCB D-sub Connector Plug, 2.743mm Pitch, with 4-40 UNC, Female Screw Lock RS Stock No. 795-2217
D1-D11 = _SMT_Krasny_lib:1N4148: DIODE high speed (Philips)
D12 = _SMT_Krasny_lib:DIODE-: DIODE
FUSE = _passive_Krasny:R: RESISTOR, European symbol
H1-H5 = holes:MOUNT-HOLE: MOUNTING HOLE with drill center marker
IC1 = linear:78*: Positive VOLTAGE REGULATOR Source: http://cache.national.com/ds/LM/LM78L05.pdf http://www.fairchildsemi.com/ds/LM/LM7805.pdf
IC2 = v-reg:LM317TS: VOLTAGE REGULATOR
IC3 = 40xx:4051: 8-channel ANALOG MULTIPLEXER
IC4 = 74xx-eu:74*04: Hex INVERTER
KK1 = heatsink:FK218: HEATSINK manufacturer Fischer/distributor Buerklin
L1 = _passive_Krasny:L: INDUCTOR
R1-R43 = rcl:R-EU_: RESISTOR, European symbol; SPICEPREFIX: R
RLY1 = _Relays_Krasny:AXICOM-V23079-D
RLY2-RLY7 = _Relays_Krasny:OMRON-G5CA-1A-E
SV1 SV2 = _Connectors_Krasny:MA04-1: PIN HEADER; OC_FARNELL: unknown; OC_NEWARK: unknown
SV3-SV9 = _Connectors_Krasny:MA03-1: PIN HEADER; OC_FARNELL: unknown; OC_NEWARK: unknown
SV10 = con-lstb:MA04-2: PIN HEADER; OC_FARNELL: unknown; OC_NEWARK: unknown
SW3 = _Connectors_Krasny:DPDT-RS_734-6956: DPDT Toggle Switch, ON(hold) -- OFF -- ON(no hold) RS Stock number 734-6956
T1-T8 = transistor:*-NPN-: NPN Transistror BF959 corrected 2008.03.06
X1-X4 = _Connectors_Krasny:5PIN_CONN_RAST3.5MM: WAGO SCREW CLAMP

## Board
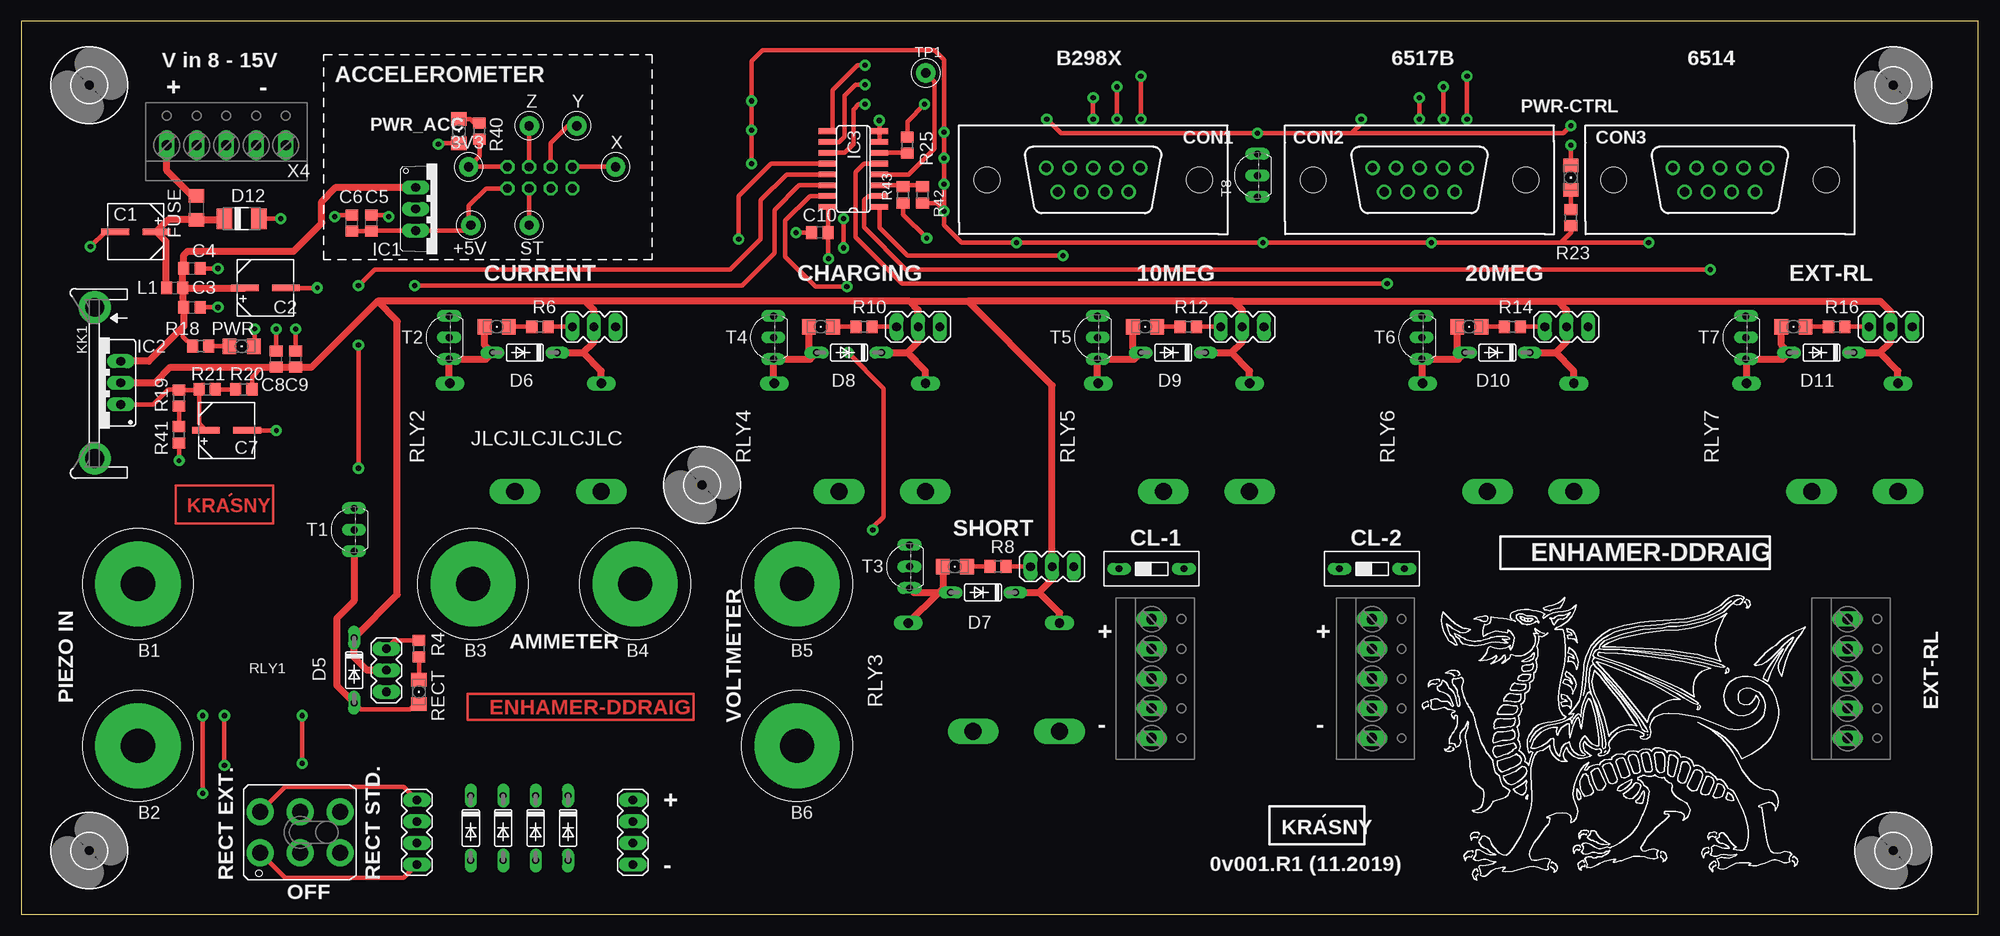
[diagram p8: board, top side]
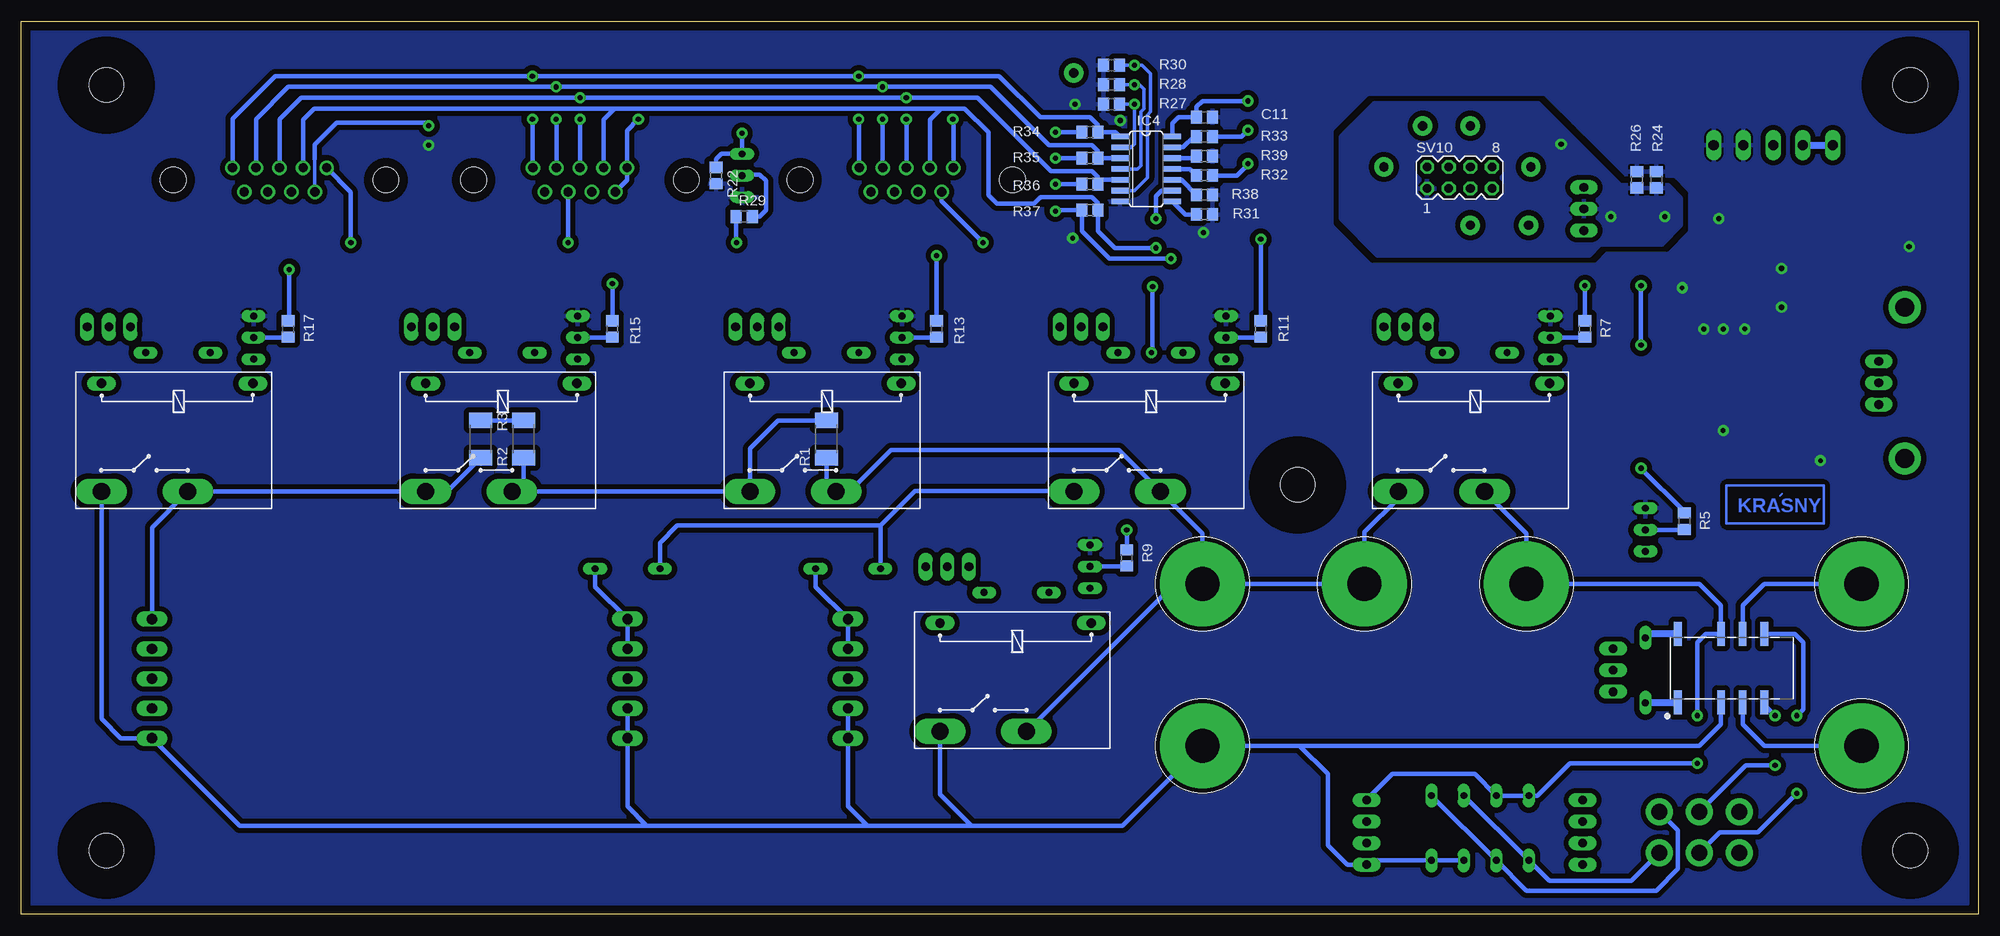
[diagram p9: board, bottom side, seen from below]

Size 230 x 105 mm. Coordinates in mm from the lower left corner, seen from the top.
Outline: 0,0 230,0 230,105 0,105 0,0
Copper layers (1*16): Top 0.035mm / dielectric 1.5mm / Bottom 0.035mm
Design rules "JLCPCB_ver001 *": minimum track width 6mil, minimum drill 0.35mm, track to track 6mil, track to pad 6mil, pad to pad 6mil, via to via 6mil, smd to smd 6mil, copper to edge 40mil, drill to drill 6mil, minimum pad ring 12mil, minimum via ring 10mil, stop-mask expansion 6mil, vias tented up to drill 25mil, thermal gap 10mil

### Footprints (pad centres in the part's own frame; a part is rotated, then mirrored left to right if it is on the bottom)
1-TEST_PIN = drill 1.1 pad 2.286: 1 0,0
1206 = smd 1.6 x 1.803: A -1.422,0; C 1.422,0
4MM-BANANA-VERTICAL = drill 4 pad 10: 1 0,0
PANASONIC-CAPAE660X800N = smd 3.251 x 0.762: 1 -2.413,0; 2 2.413,0
C0805 = smd 1.3 x 1.5: 1 -0.95,0; 2 0.95,0
DIP_SWITCH_01 = drill 0.813 long: 1 0,-3.81; 2 0,3.81
D-SUB9-VERTICAL = drill 1.092: 1 5.537,1.422; 2 2.769,1.422; 3 0,1.422; 4 -2.769,1.422; 5 -5.537,1.422; 6 4.153,-1.422; 7 1.384,-1.422; 8 -1.384,-1.422; 9 -4.153,-1.422 | hole 3.048: -12.497,0; 12.497,0
DO35-7 = drill 0.813 long: A 3.81,0; C -3.81,0
DO-214AC = smd 1.8 x 2.4: A 2.025,0; C -2.025,0
1206' = smd 1.6 x 1.8: 1 -1.4,0; 2 1.4,0
4,1 = hole 4.1: 0,0
TO220V = drill 1.016 long: 1 -2.54,-2.54; 2 0,-2.54; 3 2.54,-2.54
317TS = drill 1.016 long: 1 -2.54,-2.54; 2 0,-2.54; 3 2.54,-2.54
SO16 = smd 0.66 x 2.032: 1 -4.445,-3.073; 2 -3.175,-3.073; 3 -1.905,-3.073; 4 -0.635,-3.073; 5 0.635,-3.073; 6 1.905,-3.073; 7 3.175,-3.073; 8 4.445,-3.073; 9 4.445,3.073; 10 3.175,3.073; 11 1.905,3.073; 12 0.635,3.073; 13 -0.635,3.073; 14 -1.905,3.073; 15 -3.175,3.073; 16 -4.445,3.073
SO14 = smd 0.66 x 2.032: 1 -3.81,-3.073; 2 -2.54,-3.073; 3 -1.27,-3.073; 4 0,-3.073; 5 1.27,-3.073; 6 2.54,-3.073; 7 3.81,-3.073; 8 3.81,3.073; 9 2.54,3.073; 10 1.27,3.073; 11 0,3.073; 12 -1.27,3.073; 13 -2.54,3.073; 14 -3.81,3.073
FK218 = drill 2.21 pad 3.81: A2,2 -8.89,-0.508; B2,2 8.89,-0.508
0805 = smd 1.3 x 1.5: 1 -0.95,0; 2 0.95,0
R2010 = smd 1.8 x 2.7: 1 -2.2,0; 2 2.2,0
R0805 = smd 1.3 x 1.5: 1 -0.95,0; 2 0.95,0
AXICOM-V23079-SMT_MONO = smd 0.9 x 2.85: 1 -6.35,-4.025; 3 -1.27,-4.025; 4 1.27,-4.025; 5 3.81,-4.025; 8 3.81,4.025; 9 1.27,4.025; 10 -1.27,4.025; 12 -6.35,4.025
G5CA_MJK = drill 1.1 long: 1 -8.992,-6.553; 2 8.788,-6.553 | drill 2 pad 2.8 long: 3 1.168,6.147; 4 -8.992,6.147
MA04-1 = drill 1.016 long: 1 -3.81,0; 2 -1.27,0; 3 1.27,0; 4 3.81,0
MA03-1 = drill 1.016 long: 1 -2.54,0; 2 0,0; 3 2.54,0
MA04-2 = drill 1.016 octagon: 1 -3.81,-1.27; 2 -3.81,1.27; 3 -1.27,-1.27; 4 -1.27,1.27; 5 1.27,-1.27; 6 1.27,1.27; 7 3.81,-1.27; 8 3.81,1.27
DPDT-RS_734-6956 = drill 1.854 pad 3.175: 1 2.413,-4.699; 2 2.413,0; 4 -2.413,-4.699; 5 -2.413,0 | drill 1.905 pad 3.175: 3 2.413,4.699; 6 -2.413,4.699
TO92-CBE = drill 0.813 long: B 0,0; C -2.54,0; E 2.54,0
5PIN_CONN_RAST3.5MM = drill 1.194 long: 1 -7.031,0.008; 2 -3.531,0.008; 3 -0.031,0.008; 4 3.469,0.008; 5 6.969,0.008

### Placement (x,y rotation side)
3V3  52.58,87.88 0 top
10MEG  132.08,69.09 180 top
20MEG  170.18,69.09 180 top
+5V  52.83,81.03 0 top
B1  13.72,38.86 0 top
B2  13.72,19.81 0 top
B3  53.09,38.86 0 top
B4  72.14,38.86 0 top
B5  91.19,38.86 0 top
B6  91.19,19.81 0 top
C1  13.46,80.26 180 top
C2  28.7,73.66 0 top
C3  20.07,71.37 0 top
C4  20.07,75.95 0 top
C5  41.15,81.28 90 top
C6  38.86,81.28 90 top
C7  24.13,56.9 0 top
C8  29.97,65.28 90 top
C9  32.26,65.28 90 top
C10  93.85,80.14 180 top
C11  90.93,93.73 0 bottom
CHARGING  93.98,69.09 180 top
CL-1  132.84,40.64 270 top
CL-2  158.75,40.64 270 top
CON1  125.98,86.36 0 top
CON2  164.34,86.36 0 top
CON3  199.64,86.36 0 top
CURRENT  55.88,69.09 180 top
D1  52.83,10.16 270 top
D2  56.64,10.16 270 top
D3  60.45,10.16 270 top
D4  64.26,10.16 270 top
D5  39.12,28.7 270 top
D6  59.18,66.04 180 top
D7  113.03,37.85 180 top
D8  97.28,66.04 180 top
D9  135.38,66.04 180 top
D10  173.48,66.04 180 top
D11  211.58,66.04 180 top
D12  25.91,81.79 0 top
EXT-RL  208.28,69.09 180 top
FUSE  0.8A  [1206']  20.57,83.06 270 top
H1  8,97.5 0 top
H2  8,7.5 0 top
H3  220,97.5 0 top
H4  220,7.5 0 top
H5  80,50.5 0 top
IC1  48.9,82.93 270 top
IC2  9.14,62.48 90 top
IC3  97.79,87.63 90 top
IC4  97.79,87.63 270 bottom
KK1  9.14,62.48 270 top
L1  18.03,73.66 0 top
PWR  25.91,66.8 0 top
PWR-CTRL  182.12,86.61 90 top
PWR_ACC  51.44,92.08 270 top
R1  135.38,55.88 90 bottom
R2  170.94,55.88 90 bottom
R3  176.02,55.88 270 bottom
R4  46.74,31.24 90 top
R5  34.54,46.23 90 bottom
R6  60.96,69.09 0 top
R7  46.23,68.83 90 bottom
R8  114.81,40.89 0 top
R9  100.08,41.91 90 bottom
R10  99.06,69.09 0 top
R11  84.33,68.83 90 bottom
R12  137.16,69.09 0 top
R13  122.43,68.83 90 bottom
R14  175.26,69.09 0 top
R15  160.53,68.83 90 bottom
R16  213.36,69.09 0 top
R17  198.63,68.83 90 bottom
R18  21.08,66.8 180 top
R19  18.54,60.71 90 top
R20  26.16,61.72 0 top
R21  21.84,61.72 0 top
R22  148.34,86.87 270 bottom
R23  182.12,81.92 270 top
R24  37.85,86.36 90 bottom
R25  104.14,90.42 270 top
R26  40.13,86.36 90 bottom
R27  101.85,95.25 0 bottom
R28  101.85,97.54 0 bottom
R29  145.03,82.04 0 bottom
R30  101.85,99.82 0 bottom
R31  90.93,82.3 180 bottom
R32  90.93,86.87 0 bottom
R33  90.93,91.44 0 bottom
R34  104.39,91.95 180 bottom
R35  104.39,88.9 180 bottom
R36  104.39,85.85 180 bottom
R37  104.39,82.8 180 bottom
R38  90.93,84.58 180 bottom
R39  90.93,89.15 180 bottom
R40  53.85,92.08 270 top
R41  18.54,56.39 90 top
R42  105.92,84.58 270 top
R43  103.63,84.58 90 top
RECT  46.74,26.16 270 top
RLY1  28.96,28.96 0 bottom
RLY2  59.18,55.88 180 top
RLY3  113.03,27.69 180 top
RLY4  97.28,55.88 180 top
RLY5  135.38,55.88 180 top
RLY6  173.48,55.88 180 top
RLY7  211.58,55.88 180 top
SHORT  109.73,40.89 180 top
ST  59.69,81.03 0 top
SV1  46.48,9.65 90 top
SV2  71.88,9.65 90 top
SV3  42.93,28.7 270 top
SV4  67.31,69.09 0 top
SV5  121.16,40.89 0 top
SV6  105.41,69.09 0 top
SV7  143.51,69.09 0 top
SV8  181.61,69.09 0 top
SV9  219.71,69.09 0 top
SV10  60.96,86.61 0 bottom
SW3  32.77,9.65 270 top
T1  39.12,45.21 90 top
T2  50.29,67.82 90 top
T3  104.39,40.89 90 top
T4  88.39,67.82 90 top
T5  126.49,67.82 90 top
T6  164.59,67.82 90 top
T7  202.69,67.82 90 top
T8  145.29,86.87 90 top
TP1  106.3,98.93 0 top
X  69.85,87.88 0 top
X1  132.84,27.69 270 top
X2  158.75,27.69 270 top
X3  214.63,27.69 270 top
X4  24.13,90.42 0 top
Y  65.28,92.71 0 top
Z  59.69,92.71 0 top

### Tracks (layer width: path | path; a pad name or v marks a point on that pad's centre or on a via)
!DIO_1  (via drill 0.6 pad 1.3)
  Top 0.508: v99.19,95.25 98.42,95.25 97.79,94.61 97.79,90.55 96.77,89.53 IC3.11
  Bottom 0.406: 99.57,90.17 99.19,90.55 v99.19,95.25 R27.2
  Bottom 0.508: IC4.2 99.57,90.17
!DIO_2  (via drill 0.6 pad 1.3)
  Top 0.508: v99.19,97.54 98.04,97.54 96.77,96.27 96.77,91.44 96.14,90.81 IC3.10
  Bottom 0.406: IC4.4 98.81,87.63 98.42,88.01 98.42,94.36 98.04,94.74 98.04,97.03 98.55,97.54 v99.19,97.54 R28.2
!DIO_3  (via drill 0.6 pad 1.3)
  Top 0.508: IC3.9 95.1,92.08 95.35,92.33 95.35,96.88 98.3,99.82 v99.19,99.82
  Bottom 0.406: IC4.6 99.19,85.09 97.66,86.61 97.66,93.98 97.28,94.36 97.28,98.81 98.3,99.82 v99.19,99.82 R30.2
!DIO_4
  Bottom 0.508: R31.2 93.19,82.3 IC4.8
+3V3
  Top 0.508: SV10.8 3V3.1 53.85,89.15 R40.2
+5V_EXT  (via drill 0.6 pad 1.3)
  Top 0.406: 94.8,83.1 IC3.16
  Top 0.508: 108.46,82.8 v108.46,85.85 v108.46,88.9 v108.46,91.95 108.46,100.46 107.31,101.6 87.12,101.6 85.85,100.33 v85.85,95.63 v85.85,92.2 v85.85,88.27 | 108.46,82.8 v108.46,82.68 108.46,81.03 110.49,78.99 v116.97,78.99 v145.92,78.99 v165.74,78.99 180.97,78.99 | R23.2 182.18,80.9 182.18,80.2 180.97,78.99 | 94.8,83.1 C10.1 94.8,77.16 v94.87,77.09 | v191.26,78.99 180.97,78.99 | R42.2 107.63,83.63 108.46,82.8
  Bottom 0.508: R36.2 v108.46,85.85 | R35.2 v108.46,88.9 | R34.2 v108.46,91.95 | IC4.14 94.72,92.99 93.98,93.73 C11.1 91.88,94.94 91.19,95.63 v85.85,95.63 | R32.2 87.12,86.87 85.85,88.14 v85.85,88.27 | R33.2 86.61,91.44 v85.85,92.2 | CON2.7 165.74,84.92 v165.74,78.99 | v145.92,78.99 145.98,79.06 R29.1 | v94.87,77.09 102.1,77.09 105.34,80.33 R37.2 108.33,82.8 v108.46,82.68 | v116.97,78.99 121.83,83.86 CON1.9 | CON3.5 191.26,84.94 v191.26,78.99
ACC_X
  Top 0.508: SV10.2 X.1
ACC_Y
  Top 0.508: SV10.4 62.23,90.68 64.26,92.71 Y.1
ACC_Z
  Top 0.508: SV10.6 Z.1
CL1_P
  Bottom 0.508: X1.2 X1.1 136.65,38.52 CL-1.2
CL2_P
  Bottom 0.508: X2.2 X2.1 162.56,38.52 CL-2.2
CTRL_1  (via drill 0.6 pad 1.3)
  Top 0.508: IC3.13 89.92,87 86.87,83.95 86.87,79.38 83.31,75.82 41.53,75.82 v39.62,73.91 | v39.62,52.45 v39.62,66.93
  Bottom 0.508: R5.2 34.54,47.37 v39.62,52.45 | v39.62,66.93 v39.62,73.91
CTRL_2  (via drill 0.6 pad 1.3)
  Top 0.508: IC3.14 91.44,85.72 88.52,82.8 88.52,77.72 84.71,73.91 v46.23,73.91
  Bottom 0.508: v46.23,73.91 R7.2
CTRL_3  (via drill 0.6 pad 1.3)
  Top 0.508: IC3.15 92.71,84.45 89.79,81.53 89.79,77.34 93.34,73.79 v97.03,73.79 | v100.08,45.21 100.08,45.47 101.35,46.74 101.35,61.85 v97.16,66.04
  Bottom 0.508: R9.2 v100.08,45.21 | v97.16,66.04 97.03,66.17 v97.03,73.79
CTRL_4  (via drill 0.6 pad 1.3)
  Top 0.508: IC3.12 88.14,88.27 84.33,84.45 v84.33,79.38
  Bottom 0.508: R11.2 v84.33,79.38
CTRL_5  (via drill 0.6 pad 1.3)
  Top 0.508: IC3.1 100.86,80.75 104.14,77.47 v122.43,77.47
  Bottom 0.508: R13.2 v122.43,77.47
CTRL_6  (via drill 0.6 pad 1.3)
  Top 0.508: IC3.5 99.06,88.27 98.04,87.25 98.04,79.63 103.5,74.17 v160.53,74.17
  Bottom 0.508: R15.2 v160.53,74.17
CTRL_7  (via drill 0.6 pad 1.3)
  Top 0.508: IC3.2 99.57,84.45 99.06,83.95 99.06,80.77 104.01,75.82 v198.5,75.82
  Bottom 0.508: v198.5,75.82 198.5,69.91 R17.2
CTRL_8
  Top 0.508: TP1.1 107.31,97.92 107.31,90.02 104.29,87 IC3.4
DIO_1  (via drill 0.6 pad 1.3)
  Top 0.508: v169.93,93.47 v169.93,98.55 | v131.57,93.47 v131.57,98.55
  Bottom 0.508: CON3.1 205.18,93.52 200.15,98.55 v169.93,98.55 v131.57,98.55 115.06,98.55 110.24,93.73 104.39,93.73 103.44,92.78 R34.1 101.37,91.95 IC4.1 | CON2.1 169.88,93.42 v169.93,93.47 | CON1.1 131.52,93.42 v131.57,93.47
DIO_2  (via drill 0.6 pad 1.3)
  Top 0.508: v167.13,93.47 v167.13,97.28 | v128.78,93.47 v128.78,97.28
  Bottom 0.508: CON3.2 202.41,93.5 198.63,97.28 v167.13,97.28 v128.78,97.28 116.08,97.28 109.22,90.42 104.14,90.42 103.44,89.73 R35.1 IC4.3 | CON2.2 167.11,93.45 v167.13,93.47 | CON1.2 128.75,93.45 v128.78,93.47
DIO_3  (via drill 0.6 pad 1.3)
  Top 0.508: v164.34,93.47 v164.34,96.01 | v125.98,93.47 v125.98,96.01
  Bottom 0.508: CON3.3 199.64,93.47 197.1,96.01 v164.34,96.01 v125.98,96.01 117.6,96.01 108.97,87.38 104.14,87.38 103.44,86.68 R36.1 102.94,86.36 IC4.5 | CON2.3 v164.34,93.47 | CON1.3 v125.98,93.47
DIO_4  (via drill 0.6 pad 1.3)
  Top 0.508: v96.65,81.79 v96.65,78.36
  Bottom 0.508: CON3.4 196.88,93.45 195.58,94.74 160.27,94.74 | CON2.4 161.57,93.45 160.27,94.74 | CON1.4 123.22,93.45 121.92,94.74 | 121.92,94.74 160.27,94.74 | 121.92,94.74 119.13,94.74 116.33,91.95 116.33,84.58 115.32,83.57 111,83.57 110.24,84.33 104.14,84.33 103.44,83.63 R37.1 103.44,80.33 101.47,78.36 v96.65,78.36 | IC4.9 96.01,85.09 96.65,84.45 v96.65,81.79
GND1  (via drill 0.55 pad 1.3, 0.6 pad 1.3)
  Top 0.508: C1.2 9.91,80.26 v8.13,78.49 | C8.2 v29.97,68.83 | C9.2 v32.26,68.83 | v23.11,71.37 C3.2 | v23.11,75.95 C4.2 | v182.12,90.42 PWR-CTRL.C | v100.84,93.34 100.86,93.32 IC3.8 IC3.7 | C10.2 v91.06,80.14 | R25.1 104.14,93.22 v106.17,95.25 | R41.1 v18.54,53.34 | C7.2 v29.97,56.9 | R43.1 103.63,82.3 v106.43,79.5 | C2.2 v34.8,73.66 | v27.43,68.83 27.43,66.9 PWR.C | D12.A v30.48,81.79
  pour Bottom (isolate 0.61, rank 2): 1.27,103.73 228.73,103.73 228.73,1.27 1.27,1.27
GNDA  (via drill 0.6 pad 1.3)
  Top 0.508: C5.2 42.99,82.23 v43.18,82.04 | C6.2 37.02,82.23 v36.83,82.04 | PWR_ACC.C 49.12,90.65 v49.02,90.55
  pour Bottom (isolate 0.61): 51.69,95.38 42.04,85.72 36.45,85.72 34.92,84.2 34.92,81.03 37.21,78.74 44.45,78.74 45.72,77.47 70.61,77.47 74.93,81.79 74.93,91.44 70.99,95.38
GNDIO  (via drill 0.6 pad 1.3)
  Top 0.508: v120.52,93.47 122.17,91.82 v145.29,91.82 156.34,91.82 | v182.12,92.71 181.23,91.82 156.34,91.82 | v157.48,93.47 157.48,92.96 156.34,91.82
  Bottom 0.406: CON3.9 195.49,88.81
  Bottom 0.508: 195.49,88.81 195.49,90.51 192.91,93.09 182.5,93.09 v182.12,92.71 | R22.1 148.34,88.77 147.7,89.41 T8.E v145.29,91.82 | CON1.5 120.45,93.4 v120.52,93.47 | CON2.9 158.8,86.32 CON2.5 158.8,92.15 v157.48,93.47
N$1
  Bottom 0.508: B1.1 25.15,38.86 27.69,36.32 RLY1.9
N$2
  Bottom 0.508: B2.1 25.15,19.81 27.69,22.35 RLY1.4
N$3
  Top 0.508: SW3.1 30.99,4.32 44.96,4.32 SV1.1
N$4
  Bottom 0.508: B5.1 B4.1 72.14,44.96 68.17,48.92 RLY2.4 | B5.1 91.19,44.81 RLY4.3 100.99,54.61 127.76,54.61 132.64,49.73 RLY5.3 135.38,50.9 R1.1 | RLY3.3 111.81,21.54 94.49,38.86 B5.1
N$5
  Top 0.508: SW3.4 30.99,14.99 44.96,14.99 SV1.4
N$6
  Bottom 0.508: R3.2 179.97,49.73 RLY6.4 RLY7.3 214.64,45.51 X3.1
N$7
  Bottom 0.508: D3.C D1.A 50.42,3.94 40.77,3.94 SW3.3
N$8
  Bottom 0.508: CL-1.1 129.03,45.72 | 129.03,45.72 124.97,49.78 106.32,49.78 RLY4.4 | 129.03,45.72 152.91,45.72 154.94,43.69 CL-2.1
N$9
  Bottom 0.508: D4.C D2.A 53.09,2.79 37.85,2.79 35.31,5.33 35.31,9.91 SW3.6
N$10
  Bottom 0.508: 170.94,49.73 RLY5.4 144.37,54.76 141.06,58.08 R1.2 | 170.94,49.73 RLY6.3 | R2.1 170.94,49.73
N$11
  Bottom 0.508: R2.2 R3.1
N$12
  Top 0.508: R4.2 43.88,32.19 SV3.1
N$13
  Top 0.508: RECT.A R4.1
N$14
  Top 0.508: RECT.C 46.33,24.74 45.72,24.13 39.88,24.13 D5.A
  Top 0.813: T1.C 39.12,36.83 37.08,34.8 37.08,26.92 D5.A
  Bottom 0.813: D5.A 39.08,24.93 RLY1.1
N$15
  Top 0.508: R6.1 CURRENT.A
N$16
  Top 0.813: RLY2.2 50.29,62.53 T2.C 54.61,65.28 D6.A 54.46,66.95 CURRENT.C
N$17
  Bottom 0.508: T1.B 34.61,45.21 R5.1
N$18
  Top 0.508: SV4.1 R6.2
N$19
  Bottom 0.508: T2.B 46.29,67.82 R7.1
N$20
  Top 0.508: R8.1 SHORT.A
N$21
  Top 0.813: RLY3.2 107.85,37.85 | 107.85,37.85 108.71,37.85 D7.A | 107.85,37.85 104.9,37.85 T3.C | SHORT.C 108.31,38.3 107.85,37.85 | T3.C
N$22
  Top 0.508: SV5.1 R8.2
N$23
  Bottom 0.508: T3.B 100.14,40.89 R9.1
N$24
  Top 0.508: R10.1 CHARGING.A
N$25
  Top 0.813: CHARGING.C 92.56,66.5 93.02,66.04 D8.A 92.71,65.28 T4.C 88.39,62.53 RLY4.2
N$26
  Top 0.508: SV6.1 R10.2
N$27
  Bottom 0.508: T4.B 84.39,67.82 R11.1
N$28
  Top 0.508: R12.1 10MEG.A
N$29
  Top 0.813: 10MEG.C 130.66,66.5 131.12,66.04 D9.A 130.81,65.28 T5.C 126.49,62.53 RLY5.2
N$30
  Top 0.508: SV7.1 R12.2
N$31
  Bottom 0.508: T5.B 122.49,67.82 R13.1
N$32
  Top 0.508: R14.1 20MEG.A
N$33
  Top 0.813: 20MEG.C 168.76,66.5 169.22,66.04 D10.A 168.91,65.28 T6.C 164.69,65.18 RLY6.2
N$34
  Top 0.508: SV8.1 R14.2
N$35
  Bottom 0.508: T6.B 160.59,67.82 R15.1
N$36
  Top 0.508: R16.1 EXT-RL.A
N$37
  Top 0.813: RLY7.2 202.79,65.18 T7.C 207.01,65.28 D11.A 206.86,66.95 EXT-RL.C
N$38
  Top 0.508: SV9.1 R16.2
N$39
  Bottom 0.508: T7.B 198.69,67.82 R17.1
N$40
  Bottom 0.508: R32.1 92.64,87.63 IC4.11
N$41
  Top 0.508: PWR.A R18.1
N$42
  Top 0.508: IC2.1 15.49,59.94 17.27,61.72 18.48,61.72 R19.2 20.83,61.66 R21.1 20.89,57.72 C7.1
N$43
  Top 0.508: R20.1 R21.2
N$44
  Top 0.254: 24.46,49.23 24.71,49.48
N$45
  Top 0.305: 18.16,50.42 18.16,45.97 29.59,45.97 29.59,50.42 18.16,50.42
N$46
  Bottom 0.254: 23.32,49.2 23.06,49.45
N$47
  Bottom 0.305: 29.59,50.42 29.59,45.97 18.16,45.97 18.16,50.42 29.59,50.42
N$48
  Top 0.305: 52.45,25.91 52.45,22.86 78.99,22.86 78.99,25.91 52.45,25.91
N$49
  Top 0.508: PWR-CTRL.A R23.1
N$50
  Bottom 0.508: R29.2 143.26,82.04 142.49,82.8 142.49,86.23 143.26,87 145.16,87 T8.B
N$52
  Top 0.508: IC3.6 104.08,89.53 R25.2
N$53
  Bottom 0.508: IC4.13 93.47,90.17 92.2,91.44 R33.1
N$54
  Bottom 0.508: R38.2 93.66,86.36 IC4.10
N$55
  Bottom 0.508: IC4.12 92.14,88.9 R39.2
N$56
  Top 0.508: R40.1 53.28,93.03 52.81,93.5 PWR_ACC.A
N$57
  Top 0.508: R19.1 R41.2
PWR
  Top 0.813: L1.1 17.03,73.71 17.03,79.11 C1.1 17.27,81.66 FUSE.2 23.75,81.66 D12.C
PWR_ACC
  Top 0.508: C6.1 C5.1 41.21,80.39 IC1.3 52.2,80.39 +5V.1 52.58,81.28 52.58,83.31 54.61,85.34 SV10.7
PWR_RELAY
  Top 0.508: R20.2 27.11,63.18 28.19,64.26 28.19,64.33
  Top 0.813: SV3.2 40.64,28.7 39.12,30.23 D5.C 44.2,37.59 44.2,69.75 41.86,72.08 | 104.39,72.08 66.29,72.08 | 104.39,72.08 111.25,72.08 | 142.49,72.08 180.59,72.08 | 180.59,72.08 218.49,72.08 219.71,70.87 SV9.2 219.71,67.31 218.44,66.04 | 180.59,72.08 181.61,71.07 SV8.2 181.61,67.31 180.34,66.04 | 142.49,72.08 143.51,71.07 SV7.2 143.51,67.31 142.24,66.04 | 104.39,72.08 105.41,71.07 SV6.2 105.41,67.31 104.14,66.04 | 66.29,72.08 67.31,71.07 SV4.2 67.31,67.31 66.04,66.04 | D6.C 66.04,66.04 | RLY2.1 68.17,63.91 66.04,66.04 | D8.C 104.14,66.04 | RLY4.1 106.27,63.91 104.14,66.04 | D9.C 142.24,66.04 | RLY5.1 144.37,63.91 142.24,66.04 | D10.C 180.34,66.04 | RLY6.1 182.47,63.91 180.34,66.04 | D11.C 218.44,66.04 | RLY7.1 220.57,63.91 218.44,66.04 | D7.C 119.63,37.85 | 119.63,37.85 121.16,39.37 SV5.2 121.16,62.18 111.25,72.08 | RLY3.1 122.02,35.46 119.63,37.85 | 66.29,72.08 41.86,72.08 | 142.49,72.08 111.25,72.08 | IC2.2 15.68,62.48 17.53,64.33 28.19,64.33 C8.1 C9.1 34.1,64.33 41.86,72.08
  Bottom 0.508: 38.65,32.98 D5.C
  Bottom 0.813: RLY1.12 38.65,32.98
PWR_SUPPLY+
  Top 0.813: X4.1 17.1,87.42 20.07,84.46 FUSE.1
  Bottom 0.813: X4.2 X4.1
RCT_IN_1  (via drill 0.6 pad 1.3)
  Top 0.508: v21.34,23.37 v21.34,14.22
  Bottom 0.508: RLY1.8 21.55,32.98 20.57,32 20.57,24.13 v21.34,23.37 | v21.34,14.22 25.91,9.65 30.35,9.65 SW3.2
RCT_IN_2  (via drill 0.6 pad 1.3)
  Top 0.508: v23.88,23.37 v23.88,17.53
  Bottom 0.508: RLY1.5 25.15,24.64 v23.88,23.37 | v23.88,17.53 27.3,17.53 SW3.5
RCT_OUT_N
  Bottom 0.508: RLY1.3 30.23,22.35 32.77,19.81 79.76,19.81 | 79.76,19.81 B6.1 100.58,10.41 118.31,10.41 | X1.4 X1.5 132.85,12.7 130.56,10.41 | D3.A D4.A 71.37,6.35 SV2.1 74.17,5.84 76.45,8.13 76.45,16.51 79.76,19.81 | X2.4 X2.5 158.76,12.69 156.48,10.41 | 118.31,10.41 130.56,10.41 | 130.56,10.41 156.48,10.41 | 156.48,10.41 204.34,10.41 X3.5 218.33,20.72 220.57,22.96 RLY7.4 | RLY3.4 122.02,14.12 118.31,10.41
RCT_OUT_P  (via drill 0.6 pad 1.3)
  Top 0.508: v33.02,17.78 v33.02,23.37
  Bottom 0.508: v33.02,23.37 33.02,31.96 32,32.98 RLY1.10 30.23,36.32 32.77,38.86 B3.1 53.09,44.81 RLY2.3 | v33.02,17.78 48.01,17.78 51.82,13.97 D1.C D2.C 59.18,16.51 68.83,16.51 SV2.4
SELF_TEST
  Top 0.508: SV10.5 ST.1
V_IN+
  Top 0.508: 19.03,75.86 C4.1 | R18.2 18.99,67.94 18.99,69.03
  Top 0.813: C4.1 19.12,77.54 19.56,77.98 32,77.98 35.31,81.28 35.31,83.82 36.96,85.47 IC1.1 | L1.2 C2.1 | IC2.3 14.99,65.02 18.99,69.03 19.12,69.15 C3.1 18.98,71.51 L1.2 | L1.2 18.98,75.81 19.03,75.86
Z_OUT/IN
  Top 0.508: IC3.3 103.44,85.72 R43.2 103.83,85.72 105.72,85.72 R42.1

### Text on the board
Top: KRASNY | ENHAMER-DDRAIG
Bottom: KRASNY
tPlace: V in 8 - 15V | B298X | 6517B | 6514 | ACCELEROMETER | + | - | JLCJLCJLCJLC | ENHAMER-DDRAIG | + | + | AMMETER | PIEZO IN | EXT-RL | VOLTMETER | - | - | + | - | 0v001.R1 (11.2019) | RECT EXT. | RECT STD. | OFF
tNames: KRASNY
Document: NOTES: | 1. THE FOLLOWING INFORMATION APPLIES TO THIS BOARD: | # PCB: FR-4 EPOXY LAMINATE | # 2 COPPER LAYERS (TOP: ctrl; BOTTOM: DUT signal) | # COPPER PLATING: 1 oz (34.79 µm) | # BOARD THICKNESS: 1.6 mm | 2. BOARD DIMENSIONS: 130 x 105 [mm] | 3. LAYOUT GRID: 5 mils (0.127 mm)
Title_block: DDRAIG CONTROL BOARD | A System for Characterisation of Piezoelectric Materials / and Associated Electronics for Vibration Powered Energy / Harvesting Devices | PROJECT: ENHAMER | Department of Mechanical Engineering / University of Bath | https://github.com/enhamer | DESIGN: Marcin Jan Krasny | ver.: 0v001 | SHEET: PCB